# EAGLE board uacs (EAGLE 7.1.0)
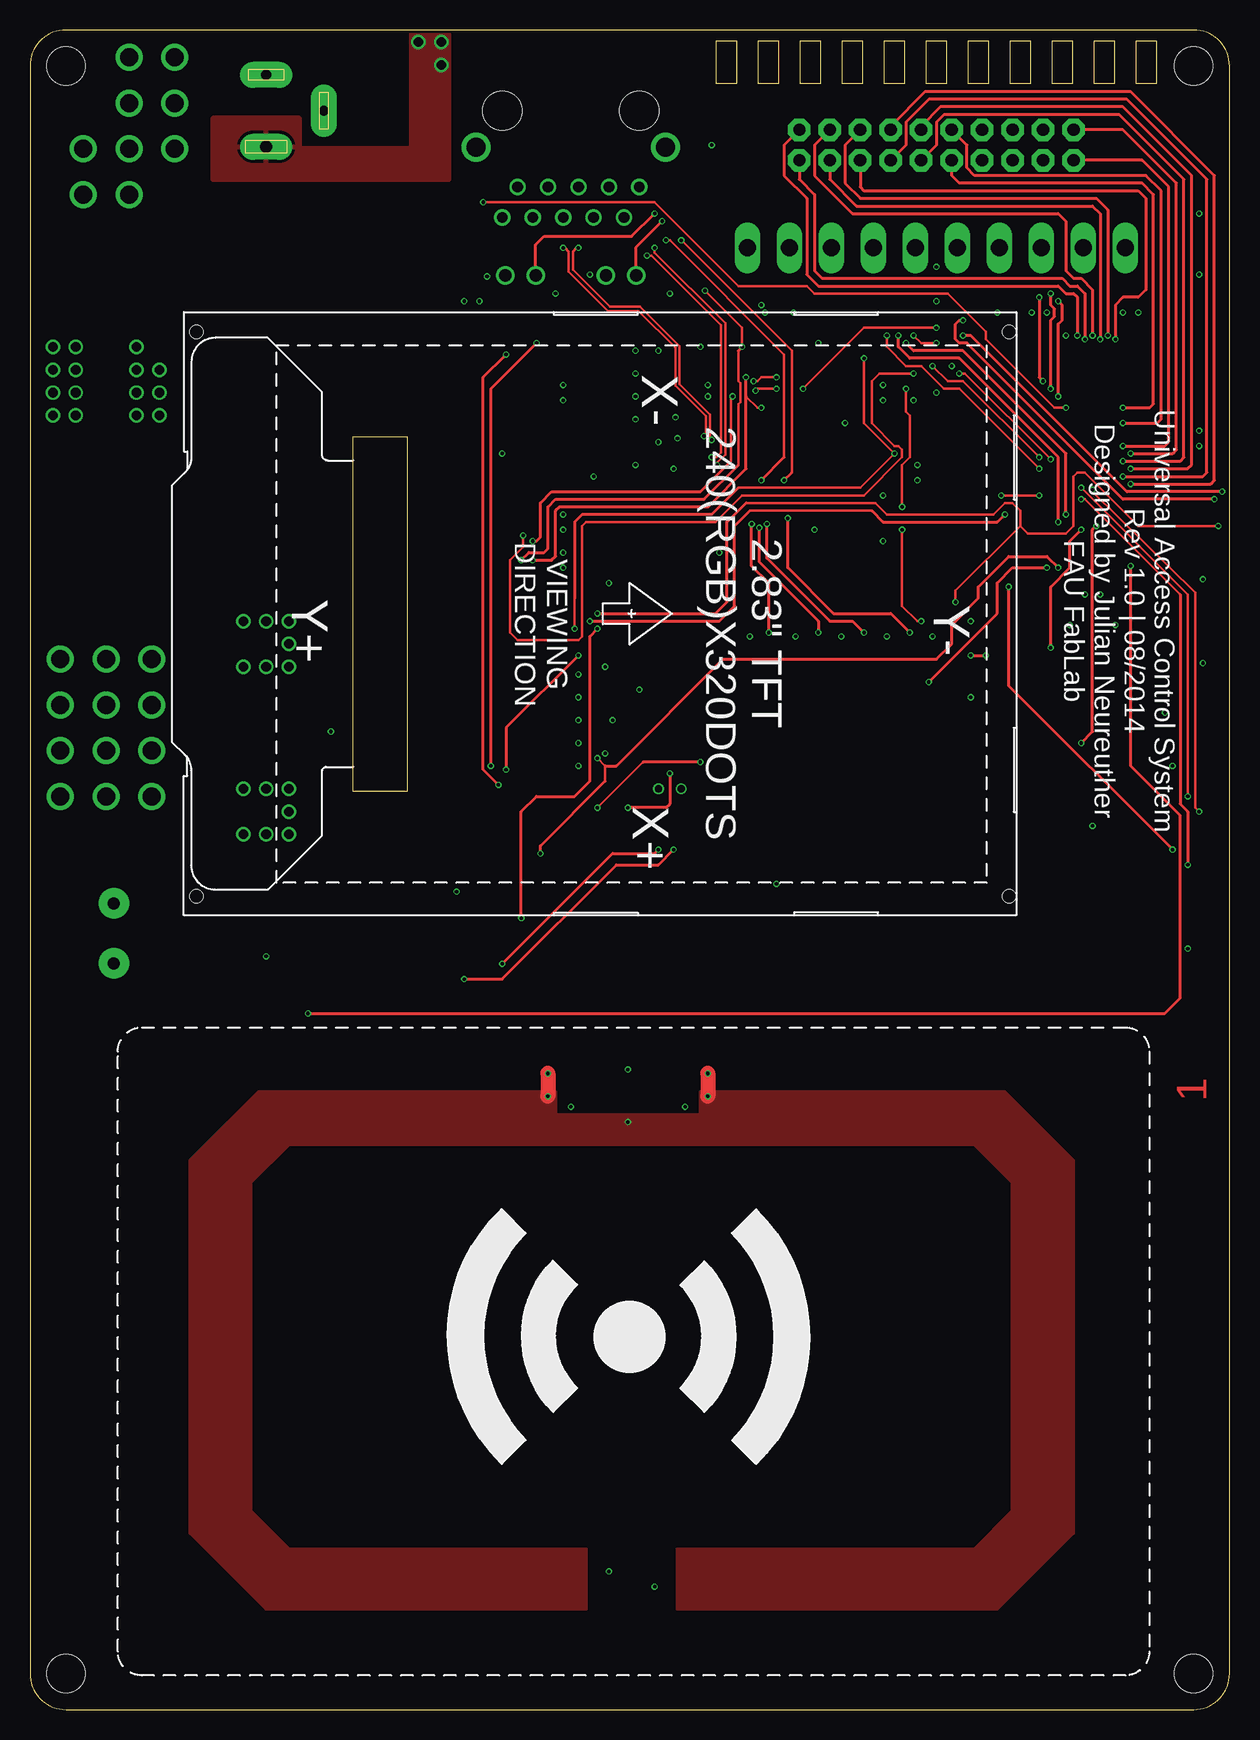
[diagram p5: board, top side]
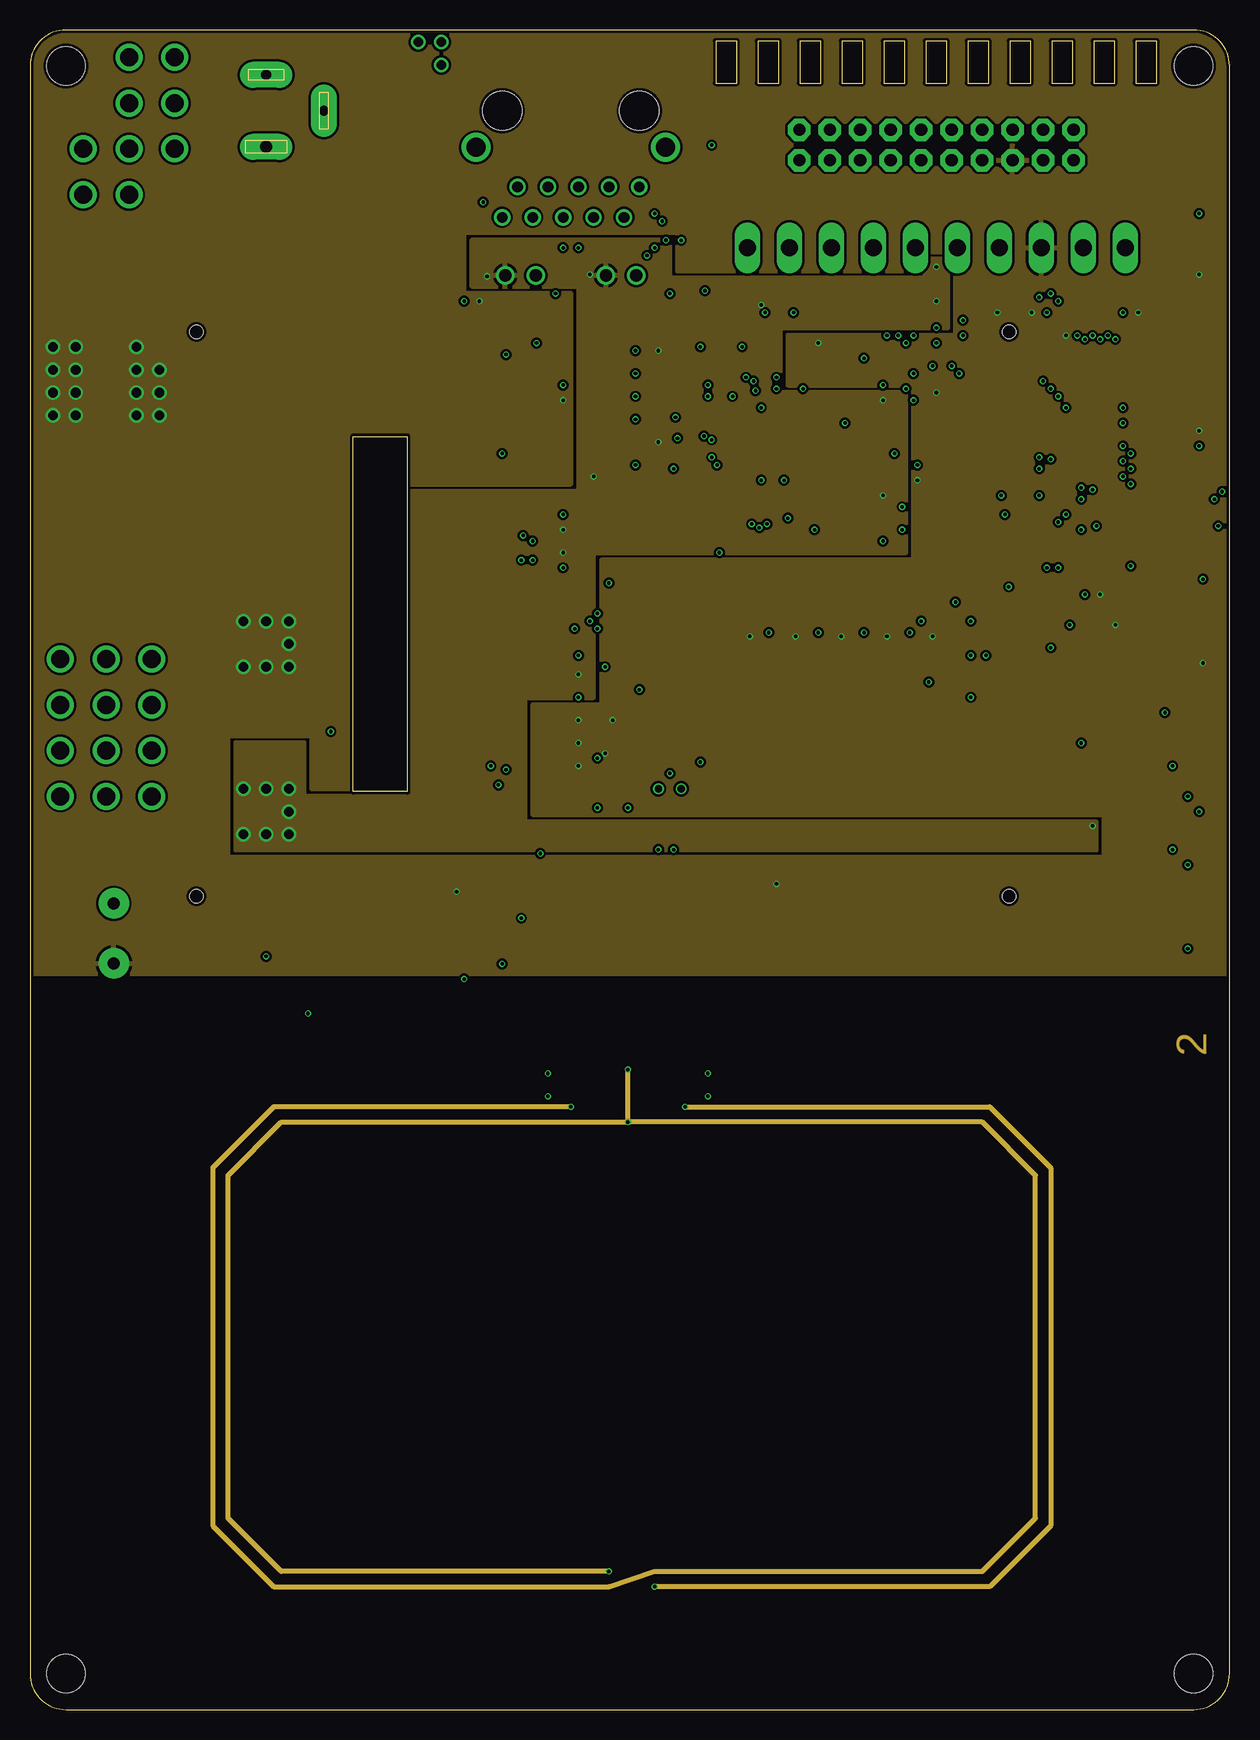
[diagram p6: board, inner layer Route2]
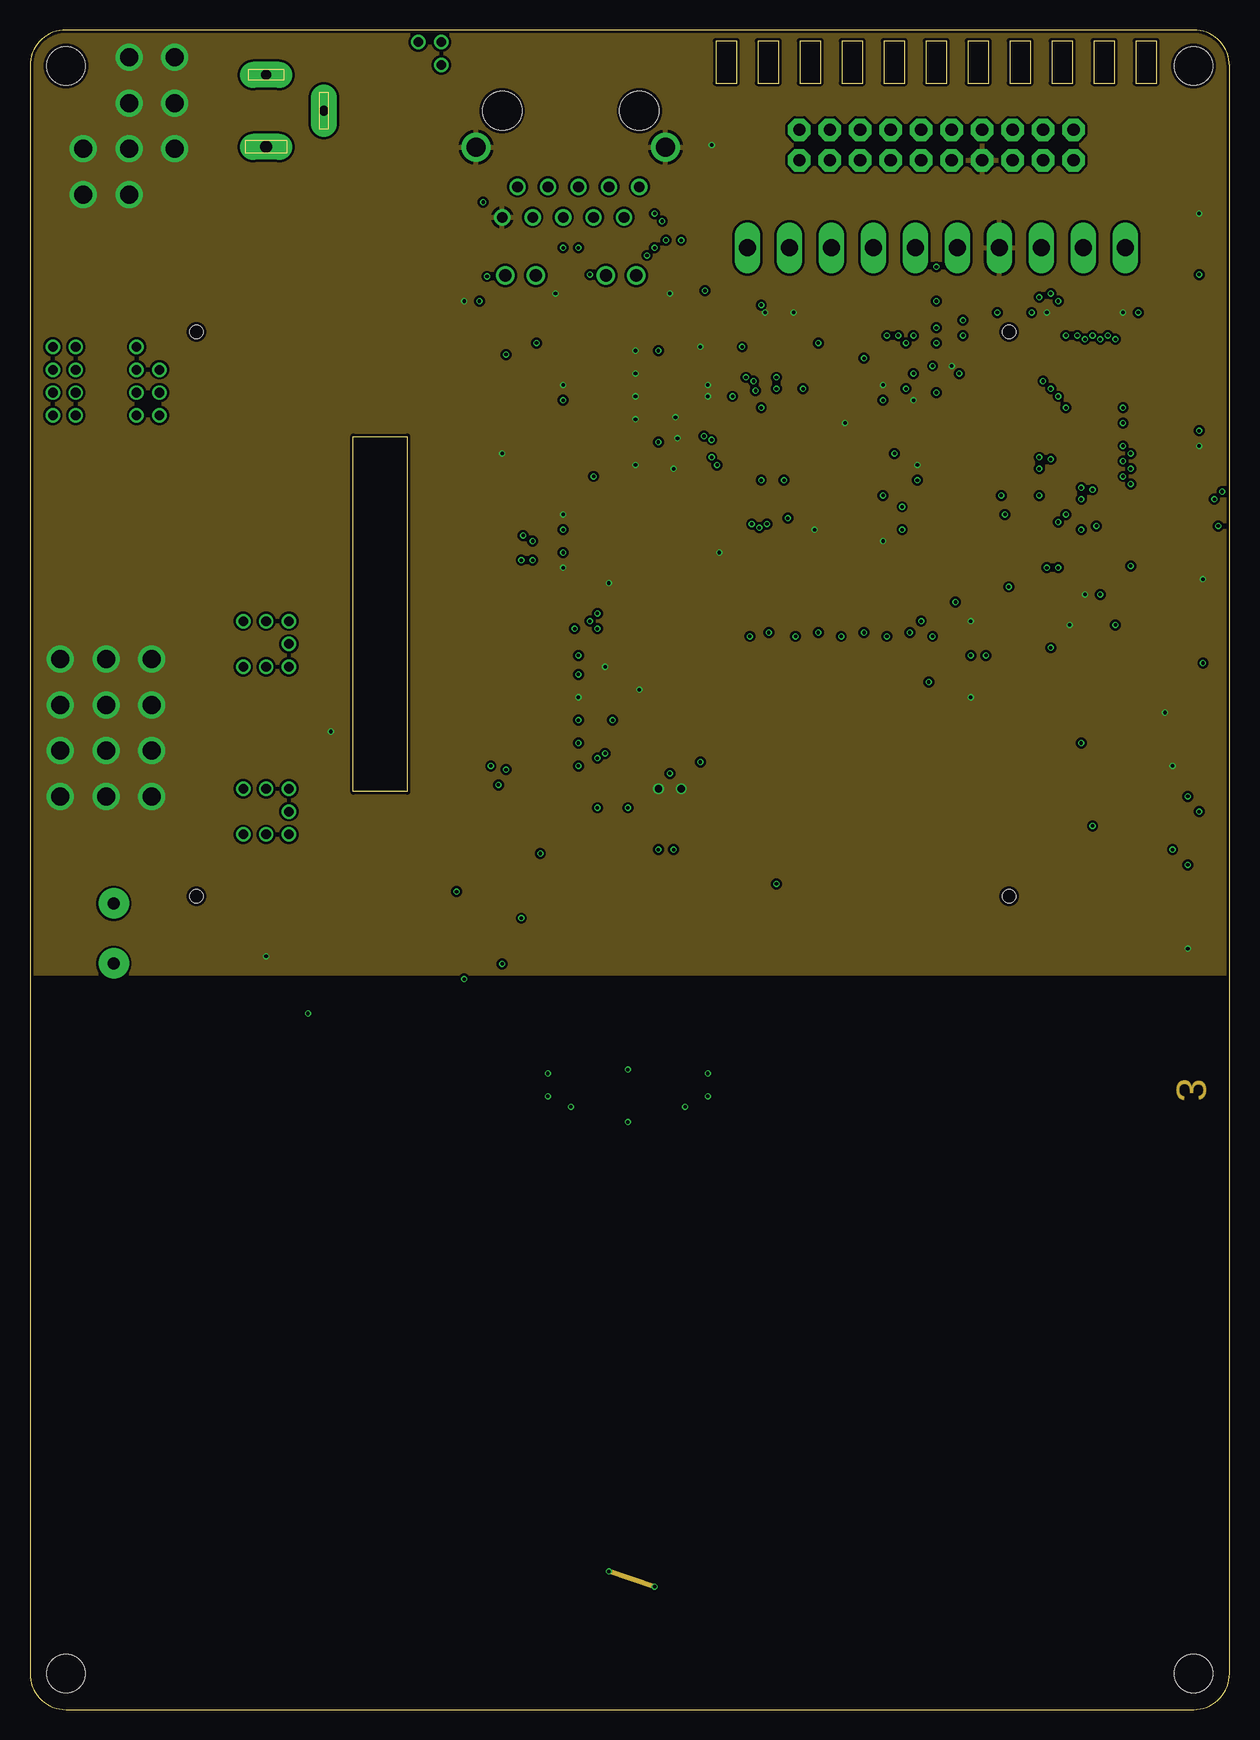
[diagram p7: board, inner layer Route15]
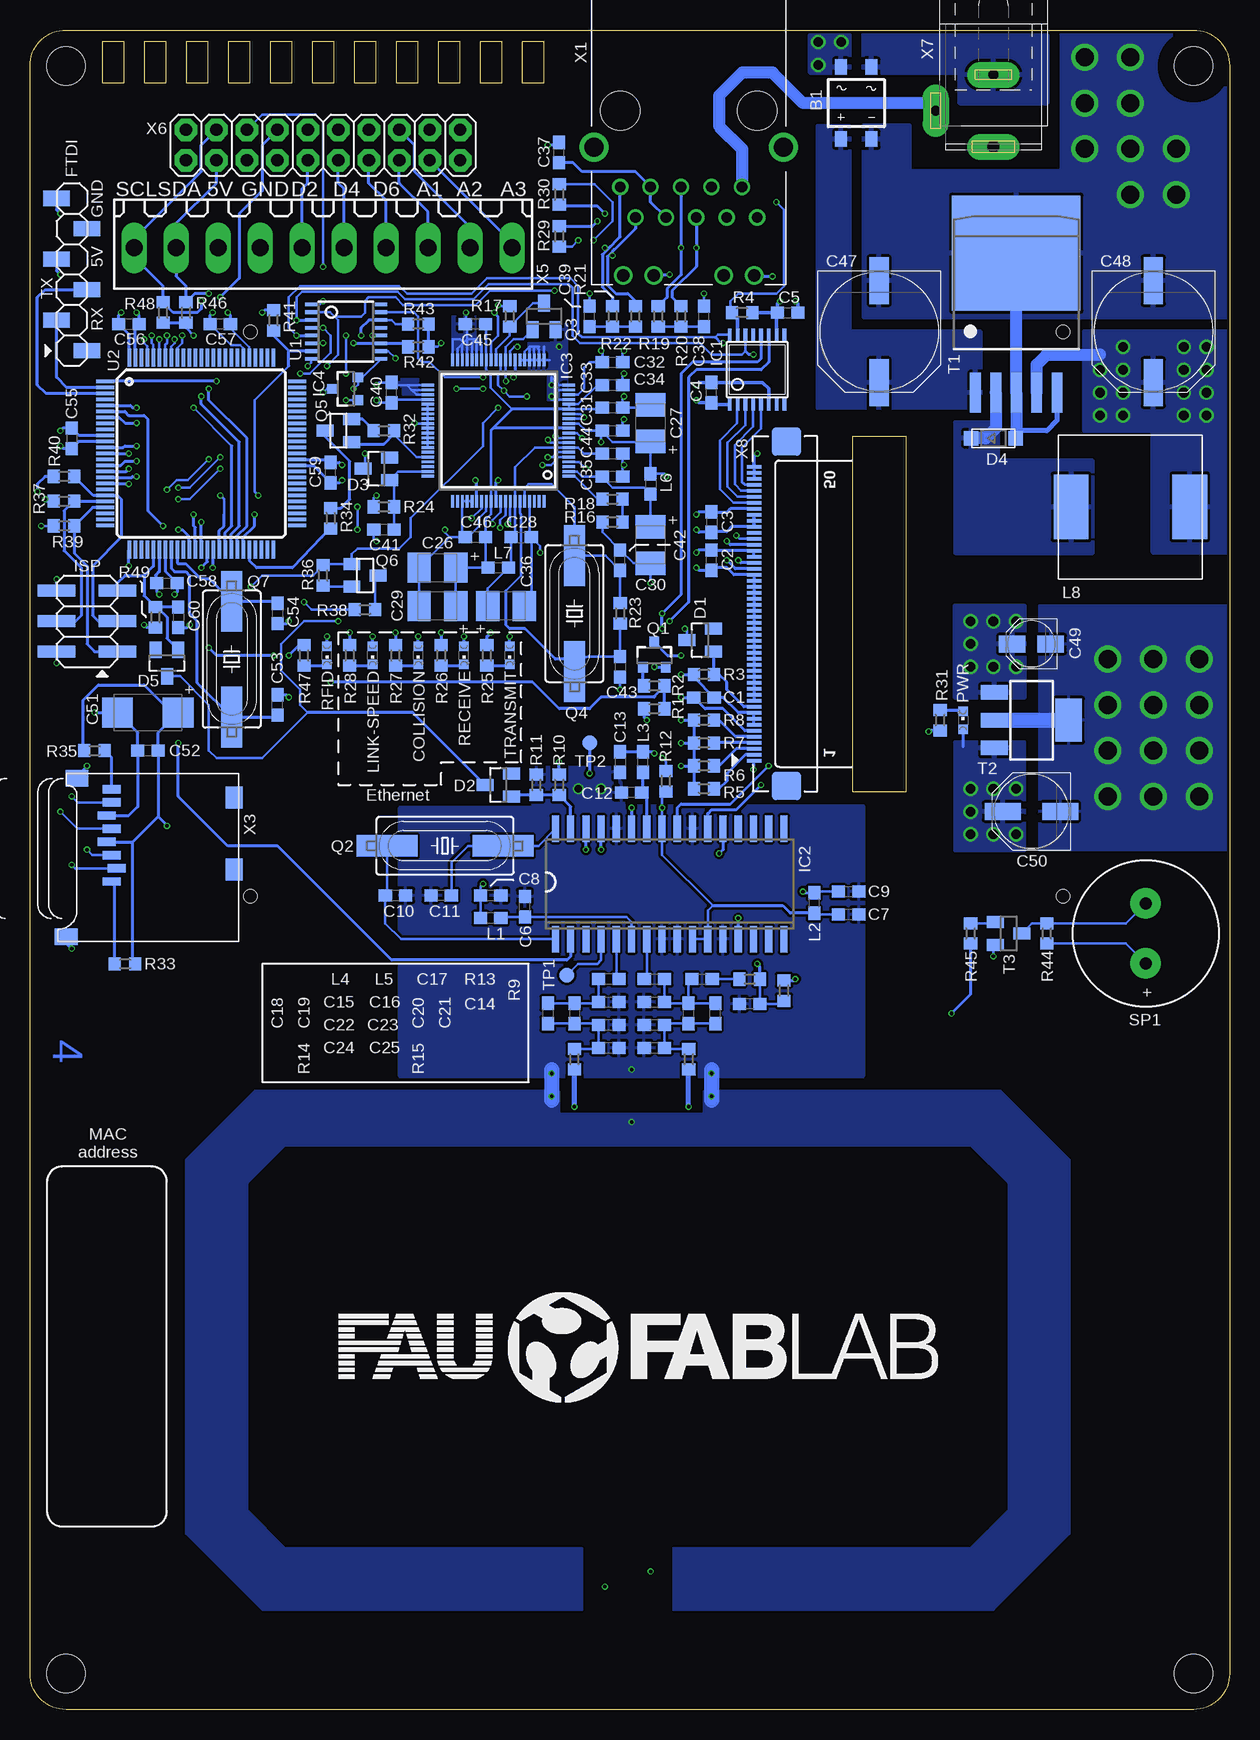
[diagram p8: board, bottom side, seen from below]

Size 100 x 140 mm. Coordinates in mm from the lower left corner, seen from the top.
Outline: 0,137 0,3 arc90 3,0 97,0 arc90 100,3 100,137 arc90 97,140 3,140 arc90 0,137
Outline: 57.18,139.08 57.18,135.58 58.93,135.58 58.93,139.08 57.18,139.08
Outline: 60.68,139.08 60.68,135.58 62.43,135.58 62.43,139.08 60.68,139.08
Outline: 64.18,139.08 64.18,135.58 65.93,135.58 65.93,139.08 64.18,139.08
Outline: 67.68,139.08 67.68,135.58 69.43,135.58 69.43,139.08 67.68,139.08
Outline: 71.18,139.08 71.18,135.58 72.93,135.58 72.93,139.08 71.18,139.08
Outline: 74.68,139.08 74.68,135.58 76.43,135.58 76.43,139.08 74.68,139.08
Outline: 78.18,139.08 78.18,135.58 79.93,135.58 79.93,139.08 78.18,139.08
Outline: 81.68,139.08 81.68,135.58 83.43,135.58 83.43,139.08 81.68,139.08
Outline: 85.18,139.08 85.18,135.58 86.93,135.58 86.93,139.08 85.18,139.08
Outline: 88.68,139.08 88.68,135.58 90.43,135.58 90.43,139.08 88.68,139.08
Outline: 92.18,139.08 92.18,135.58 93.93,135.58 93.93,139.08 92.18,139.08
Copper layers (1*2*15*16): Top 0.035mm / dielectric 0.2mm / Route2 0.0175mm / dielectric 0.3mm / Route15 0.0175mm / dielectric 0.2mm / Bottom 0.035mm
Design rules "SeeedStudio_4layer_DRU_no_angle_20140221 *": minimum track width 6mil, minimum drill 0.3mm, track to track 8mil, track to pad 8mil, pad to pad 8mil, via to via 8mil, smd to smd 0mil, copper to edge 10mil, drill to drill 8mil, minimum pad ring 6mil, minimum via ring 4mil, stop-mask expansion 4mil, vias tented up to drill 100mil, thermal gap 10mil
Holes 3.2 mm at 3,137 97,137 3,3 97,3
tRestrict: area 0,134 to 6,140; area 94,134 to 100,140; area 94,0 to 100,6; area 0,0 to 6,6
bRestrict: area 0,134 to 6,140; area 94,134 to 100,140; area 94,0 to 100,6; area 0,0 to 6,6
Milling: 44 lines

## Footprints (pad centres in the part's own frame; a part is rotated, then mirrored left to right if it is on the bottom)
MBS = smd 1 x 1.3: + -1.27,-3; - 1.27,-3; AC1 -1.27,3; AC2 1.27,3
C0603 = smd 1.1 x 1: 1 -0.85,0; 2 0.85,0
B/3528-21R = smd 1.95 x 2.5: + 1.525,0; - -1.525,0
PANASONIC_G = smd 3.9 x 1.6: + 4.25,0; - -4.25,0
PANASONIC_B = smd 2.2 x 1.4: + 1.6,0; - -1.6,0
PANASONIC_D = smd 3 x 1.4: + 2.4,0; - -2.4,0
C/6032-28R = smd 2.55 x 2.5: + 2.525,0; - -2.525,0
CHIPLED_0603 = smd 0.8 x 0.8: A 0,-0.75; C 0,0.75
SOT23 = smd 1 x 1.4: 1 -0.95,-1.1; 2 0.95,-1.1; 3 0,1.1
SOD-123 = smd 1.2 x 1.2: A 1.85,0; C -1.85,0
1X6 = smd 1.27 x 2.2: 1 6.35,1.27; 2 3.81,-1.27; 3 1.27,1.27; 4 -1.27,-1.27; 5 -3.81,1.27; 6 -6.35,-1.27
TSSOP16 = smd 0.305 x 0.991: 1 -2.925,-2.918; 2 -2.275,-2.918; 3 -1.625,-2.918; 4 -0.975,-2.918; 5 -0.325,-2.918; 6 0.325,-2.918; 7 0.975,-2.918; 8 1.625,-2.918; 9 1.625,2.918; 10 0.975,2.918; 11 0.325,2.918; 12 -0.325,2.918; 13 -0.975,2.918; 14 -1.625,2.918; 15 -2.275,2.918; 16 -2.925,2.918
SO32 = smd 0.6 x 2.2: 1 -9.525,-4.6; 2 -8.255,-4.6; 3 -6.985,-4.6; 4 -5.715,-4.6; 5 -4.445,-4.6; 6 -3.175,-4.6; 7 -1.905,-4.6; 8 -0.635,-4.6; 9 0.635,-4.6; 10 1.905,-4.6; 11 3.175,-4.6; 12 4.445,-4.6; 13 5.715,-4.6; 14 6.985,-4.6; 15 8.255,-4.6; 16 9.525,-4.6; 17 9.525,4.6; 18 8.255,4.6; 19 6.985,4.6; 20 5.715,4.6; 21 4.445,4.6; 22 3.175,4.6; 23 1.905,4.6; 24 0.635,4.6; 25 -0.635,4.6; 26 -1.905,4.6; 27 -3.175,4.6; 28 -4.445,4.6; 29 -5.715,4.6; 30 -6.985,4.6; 31 -8.255,4.6; 32 -9.525,4.6
SQFP-S-10X10-80 = smd 0.241 x 1.041: 1 -3.8,-5.879; 2 -3.4,-5.879; 3 -3,-5.879; 4 -2.6,-5.879; 5 -2.2,-5.879; 6 -1.8,-5.879; 7 -1.4,-5.879; 8 -1,-5.879; 9 -0.6,-5.879; 10 -0.2,-5.879; 11 0.2,-5.879; 12 0.6,-5.879; 13 1,-5.879; 14 1.4,-5.879; 15 1.8,-5.879; 16 2.2,-5.879; 17 2.6,-5.879; 18 3,-5.879; 19 3.4,-5.879; 20 3.8,-5.879; 41 3.8,5.879; 42 3.4,5.879; 43 3,5.879; 44 2.6,5.879; 45 2.2,5.879; 46 1.8,5.879; 47 1.4,5.879; 48 1,5.879; 49 0.6,5.879; 50 0.2,5.879; 51 -0.2,5.879; 52 -0.6,5.879; 53 -1,5.879; 54 -1.4,5.879; 55 -1.8,5.879; 56 -2.2,5.879; 57 -2.6,5.879; 58 -3,5.879; 59 -3.4,5.879; 60 -3.8,5.879 | smd 1.041 x 0.241: 21 5.879,-3.8; 22 5.879,-3.4; 23 5.879,-3; 24 5.879,-2.6; 25 5.879,-2.2; 26 5.879,-1.8; 27 5.879,-1.4; 28 5.879,-1; 29 5.879,-0.6; 30 5.879,-0.2; 31 5.879,0.2; 32 5.879,0.6; 33 5.879,1; 34 5.879,1.4; 35 5.879,1.8; 36 5.879,2.2; 37 5.879,2.6; 38 5.879,3; 39 5.879,3.4; 40 5.879,3.8; 61 -5.879,3.8; 62 -5.879,3.4; 63 -5.879,3; 64 -5.879,2.6; 65 -5.879,2.2; 66 -5.879,1.8; 67 -5.879,1.4; 68 -5.879,1; 69 -5.879,0.6; 70 -5.879,0.2; 71 -5.879,-0.2; 72 -5.879,-0.6; 73 -5.879,-1; 74 -5.879,-1.4; 75 -5.879,-1.8; 76 -5.879,-2.2; 77 -5.879,-2.6; 78 -5.879,-3; 79 -5.879,-3.4; 80 -5.879,-3.8
SOT-23-3 = smd 0.8 x 0.9: 1 -0.95,-1; 2 0.95,-1; 3 0,1.1
2X3 = smd 1 x 3.15: 1 -2.54,-2.54; 2 -2.54,2.54; 3 0,-2.54; 4 0,2.54; 5 2.54,-2.54; 6 2.54,2.54
0603 = smd 1.1 x 1: 1 -0.85,0; 2 0.85,0
WE-PD_1260/1245/1280/1210 = smd 2.9 x 5.4: 1 -4.95,0; 2 4.95,0
MI0283QT-11 = smd 1.2 x 0.275 bottom: 1 -10.525,-12.268; 2 -10.525,-11.768; 3 -10.525,-11.268; 4 -10.525,-10.768; 5 -10.525,-10.268; 6 -10.525,-9.768; 7 -10.525,-9.268; 8 -10.525,-8.768; 9 -10.525,-8.268; 10 -10.525,-7.768; 11 -10.525,-7.268; 12 -10.525,-6.768; 13 -10.525,-6.268; 14 -10.525,-5.768; 15 -10.525,-5.268; 16 -10.525,-4.768; 17 -10.525,-4.268; 18 -10.525,-3.768; 19 -10.525,-3.268; 20 -10.525,-2.768; 21 -10.525,-2.268; 22 -10.525,-1.768; 23 -10.525,-1.268; 24 -10.525,-0.768; 25 -10.525,-0.268; 26 -10.525,0.232; 27 -10.525,0.732; 28 -10.525,1.232; 29 -10.525,1.732; 30 -10.525,2.232; 31 -10.525,2.732; 32 -10.525,3.232; 33 -10.525,3.732; 34 -10.525,4.232; 35 -10.525,4.732; 36 -10.525,5.232; 37 -10.525,5.732; 38 -10.525,6.232; 39 -10.525,6.732; 40 -10.525,7.232; 41 -10.525,7.732; 42 -10.525,8.232; 43 -10.525,8.732; 44 -10.525,9.232; 45 -10.525,9.732; 46 -10.525,10.232; 47 -10.525,10.732; 48 -10.525,11.232; 49 -10.525,11.732; 50 -10.525,12.232 | smd 2.4 x 2.4 bottom: GND2 -13.225,14.332; PAD3 -13.225,-14.368 | hole 1.1: -36.28,-23.57; -36.28,23.47; 31.47,-23.57; 31.47,23.47
SOT23-3 = smd 0.8 x 0.9: 1 -0.95,-1; 2 0.95,-1; 3 0,1.1
SM49 = smd 5.08 x 1.778: 1 -4.826,0; 2 4.826,0
R0603 = smd 1 x 1.1: 1 -0.85,0; 2 0.85,0
PS12 = drill 1 pad 2.54: P$1 -2.5,0; P$2 2.5,0
TO-263-5 = smd 0.9 x 3.3: 1 -3.4,0; 2 -1.7,0; 3 0,0; 4 1.7,0; 5 3.4,0 | smd 10.7 x 9.6: TAB 0,11.616
SOT223 = smd 1.219 x 2.235: 1 -2.311,-3.099; 2 0,-3.099; 3 2.311,-3.099 | smd 3.6 x 2.2: 4 0,3.099
B1,27 = smd 1.27 x 1.27: TP 0,0
TSSOP16' = smd 0.305 x 0.991: 1 -2.275,-2.918; 2 -1.625,-2.918; 3 -0.975,-2.918; 4 -0.325,-2.918; 5 0.325,-2.918; 6 0.975,-2.918; 7 1.625,-2.918; 8 2.275,-2.918; 9 2.275,2.918; 10 1.625,2.918; 11 0.975,2.918; 12 0.325,2.918; 13 -0.325,2.918; 14 -0.975,2.918; 15 -1.625,2.918; 16 -2.275,2.918
TQFP100 = smd 1.5 x 0.3: 1 -8,6; 2 -8,5.5; 3 -8,5; 4 -8,4.5; 5 -8,4; 6 -8,3.5; 7 -8,3; 8 -8,2.5; 9 -8,2; 10 -8,1.5; 11 -8,1; 12 -8,0.5; 13 -8,0; 14 -8,-0.5; 15 -8,-1; 16 -8,-1.5; 17 -8,-2; 18 -8,-2.5; 19 -8,-3; 20 -8,-3.5; 21 -8,-4; 22 -8,-4.5; 23 -8,-5; 24 -8,-5.5; 25 -8,-6; 51 8,-6; 52 8,-5.5; 53 8,-5; 54 8,-4.5; 55 8,-4; 56 8,-3.5; 57 8,-3; 58 8,-2.5; 59 8,-2; 60 8,-1.5; 61 8,-1; 62 8,-0.5; 63 8,0; 64 8,0.5; 65 8,1; 66 8,1.5; 67 8,2; 68 8,2.5; 69 8,3; 70 8,3.5; 71 8,4; 72 8,4.5; 73 8,5; 74 8,5.5; 75 8,6 | smd 0.3 x 1.5: 26 -6,-8; 27 -5.5,-8; 28 -5,-8; 29 -4.5,-8; 30 -4,-8; 31 -3.5,-8; 32 -3,-8; 33 -2.5,-8; 34 -2,-8; 35 -1.5,-8; 36 -1,-8; 37 -0.5,-8; 38 0,-8; 39 0.5,-8; 40 1,-8; 41 1.5,-8; 42 2,-8; 43 2.5,-8; 44 3,-8; 45 3.5,-8; 46 4,-8; 47 4.5,-8; 48 5,-8; 49 5.5,-8; 50 6,-8; 76 6,8; 77 5.5,8; 78 5,8; 79 4.5,8; 80 4,8; 81 3.5,8; 82 3,8; 83 2.5,8; 84 2,8; 85 1.5,8; 86 1,8; 87 0.5,8; 88 0,8; 89 -0.5,8; 90 -1,8; 91 -1.5,8; 92 -2,8; 93 -2.5,8; 94 -3,8; 95 -3.5,8; 96 -4,8; 97 -4.5,8; 98 -5,8; 99 -5.5,8; 100 -6,8
7499210124A = drill 0.9: 1 -5.715,-3.81; 2 -4.445,-6.35; 3 -3.175,-3.81; 4 -1.905,-6.35; 5 -0.635,-3.81; 6 0.635,-6.35; 7 1.905,-3.81; 8 3.175,-6.35; 9 4.445,-3.81; 10 5.715,-6.35 | drill 1.02: 11 -5.465,-11.18; 12 -2.925,-11.18; 13 2.925,-11.18; 14 5.465,-11.18 | drill 1.6: Z1 -7.9,-0.51; Z2 7.9,-0.51 | hole 3.25: 5.715,2.54; -5.715,2.54
MICROSD = smd 0.7 x 1.5: 1 9,-10.64; 2 7.9,-10.24; 3 6.8,-10.64; 4 5.7,-11.04; 5 4.6,-10.64; 6 3.5,-11.04; 7 2.4,-10.64; 8 1.3,-10.64 | smd 1.8 x 1.4: CD1 2,-0.44; CD2 8,-0.44 | smd 1.4 x 1.9: MT1 0.4,-13.54; MT2 13.6,-14.44
180-10 = drill 1.422 long: 1 -15.75,0; 2 -12.25,0; 3 -8.75,0; 4 -5.25,0; 5 -1.75,0; 6 1.75,0; 7 5.25,0; 8 8.75,0; 9 12.25,0; 10 15.75,0
2X10 = drill 1.016 pad 1.88 octagon: 1 -11.43,-1.27; 2 -11.43,1.27; 3 -8.89,-1.27; 4 -8.89,1.27; 5 -6.35,-1.27; 6 -6.35,1.27; 7 -3.81,-1.27; 8 -3.81,1.27; 9 -1.27,-1.27; 10 -1.27,1.27; 11 1.27,-1.27; 12 1.27,1.27; 13 3.81,-1.27; 14 3.81,1.27; 15 6.35,-1.27; 16 6.35,1.27; 17 8.89,-1.27; 18 8.89,1.27; 19 11.43,-1.27; 20 11.43,1.27
SPC4078 = drill 0.8 pad 2.184 long: 1 -3,0; 2 0,-4.8 | drill 1 pad 2.184 long: 3 3,0

## Placement (x,y rotation side)
B1  CDBHD2100-G  [MBS]  31.11,133.91 0 bottom
C1  100n  [C0603]  43.81,84.38 0 bottom
C2  100n  [C0603]  43.18,95.8 90 bottom
C3  100n  [C0603]  43.18,98.98 270 bottom
C4  100n  [C0603]  43.18,109.77 90 bottom
C5  100n  [C0603]  36.83,116.44 0 bottom
C6  100n  [C0603]  58.74,66.91 90 bottom
C7  100n  [C0603]  31.75,66.28 0 bottom
C8  56p  [C0603]  61.59,67.86 0 bottom
C9  56p  [C0603]  31.75,68.18 0 bottom
C10  15p  [C0603]  69.53,67.86 0 bottom
C11  15p  [C0603]  65.72,67.86 180 bottom
C12  100n  [C0603]  49.85,76.44 180 bottom
C13  56p  [C0603]  50.8,78.98 270 bottom
C14  100n  [C0603]  40.01,58.82 180 bottom
C15  68p  [C0603]  51.75,58.97 0 bottom
C16  68p  [C0603]  47.94,58.97 0 bottom
C17  1n  [C0603]  43.97,60.88 0 bottom
C18  20p  [C0603]  56.83,58.02 270 bottom
C19  20p  [C0603]  54.61,58.02 270 bottom
C20  20p  [C0603]  45.09,58.02 90 bottom
C21  20p  [C0603]  42.86,58.02 90 bottom
C22  220p  [C0603]  51.75,57.07 0 bottom
C23  220p  [C0603]  47.94,57.07 0 bottom
C24  200p  [C0603]  51.75,55.16 0 bottom
C25  200p  [C0603]  47.94,55.16 0 bottom
C26  3.3u  [B/3528-21R]  66.04,95.17 0 bottom
C27  10uF  [B/3528-21R]  48.26,107.23 270 bottom
C28  100n  [C0603]  59.05,97.71 0 bottom
C29  10uF  [B/3528-21R]  66.04,91.99 0 bottom
C30  10uF  [B/3528-21R]  48.26,97.08 90 bottom
C31  100n  [C0603]  51.44,106.6 0 bottom
C32  100n  [C0603]  51.44,112.31 0 bottom
C33  100n  [C0603]  51.44,108.5 0 bottom
C34  100n  [C0603]  51.44,110.41 0 bottom
C35  10n  [C0603]  51.44,102.79 0 bottom
C36  10uF  [B/3528-21R]  60.33,91.99 180 bottom
C37  100n  [C0603]  55.88,129.78 90 bottom
C38  100n  [C0603]  43.81,116.12 90 bottom
C39  100n  [C0603]  53.34,116.12 90 bottom
C40  100n  [C0603]  69.85,109.77 90 bottom
C41  47n  [C0603]  70.48,98.34 180 bottom
C42  13p  [C0603]  50.8,95.8 90 bottom
C43  13p  [C0603]  50.8,86.91 270 bottom
C44  100n  [C0603]  51.44,104.69 0 bottom
C45  100n  [C0603]  62.87,115.49 180 bottom
C46  100n  [C0603]  62.87,97.71 180 bottom
C47  100u  [PANASONIC_G]  29.21,114.86 270 bottom
C48  470u  [PANASONIC_G]  6.35,114.86 270 bottom
C49  470n  [PANASONIC_B]  16.51,88.82 180 bottom
C50  33u  [PANASONIC_D]  16.51,74.85 180 bottom
C51  33u  [C/6032-28R]  90.17,83.11 0 bottom
C52  100n  [C0603]  90.17,79.93 180 bottom
C53  22p  [C0603]  79.38,83.74 90 bottom
C54  22p  [C0603]  79.38,91.36 270 bottom
C55  100n  [C0603]  96.52,105.97 270 bottom
C56  100n  [C0603]  91.76,115.49 0 bottom
C57  100n  [C0603]  84.14,115.49 180 bottom
C58  100n  [C0603]  88.58,93.9 0 bottom
C59  100n  [C0603]  74.93,103.11 90 bottom
C60  100n  [C0603]  87.63,91.04 270 bottom
COLLISION  RED  [CHIPLED_0603]  67.63,87.87 180 bottom
D1  BAT54  [SOT23]  44.13,89.14 90 bottom
D2  BAT54  [SOT23]  60.96,77.07 90 bottom
D3  BAT54  [SOT23]  71.12,103.42 90 bottom
D4  PMEG6020ER  [SOD-123]  19.68,105.97 0 bottom
D5  BAT54  [SOT23]  88.58,87.23 180 bottom
FTDI  1X6  [1X6]  96.52,119.62 270 bottom
IC1  TSC2046  [TSSOP16]  38.73,111.68 0 bottom
IC2  MFRC531  [SO32]  46.67,68.82 0 bottom
IC3  W5100  [SQFP-S-10X10-80]  60.96,106.6 90 bottom
IC4  STM809L  [SOT-23-3]  73.66,110.09 90 bottom
ISP  ISP  [2X3]  95.25,90.72 90 bottom
L1  22n  [0603]  61.59,65.96 180 bottom
L2  22n  [0603]  34.61,67.23 90 bottom
L3  22n  [0603]  48.9,78.98 90 bottom
L4  1u  [0603]  51.75,60.88 180 bottom
L5  1u  [0603]  47.94,60.88 0 bottom
L6  1u 250mA  [0603]  48.26,102.16 270 bottom
L7  1u 250mA  [0603]  60.96,95.17 0 bottom
L8  SRR1260-331K  [WE-PD_1260/1245/1280/1210]  8.26,100.25 0 bottom
LINK-SPEED  GRN  [CHIPLED_0603]  71.44,87.87 180 bottom
P1  MI0283QT-11  [MI0283QT-11]  50.16,91.36 0 top
PWR  GREEN  [CHIPLED_0603]  22.23,82.47 0 bottom
Q1  MMBT2222  [SOT23-3]  47.94,87.87 0 bottom
Q2  13.56MHz  [SM49]  65.41,71.99 180 bottom
Q3  2N7002  [SOT23]  57.15,116.12 0 bottom
Q4  25MHz  [SM49]  54.61,91.36 90 bottom
Q5  BSS138  [SOT23]  74.3,106.6 90 bottom
Q6  BSS138  [SOT23]  72.07,94.53 270 bottom
Q7  16MHz  [SM49]  83.19,87.55 270 bottom
R1  1k  [R0603]  47.94,83.42 0 bottom
R2  1k  [R0603]  47.94,85.33 180 bottom
R3  10K  [R0603]  43.81,86.28 180 bottom
R4  10K  [R0603]  40.64,116.44 0 bottom
R5  100R  [R0603]  43.81,76.75 180 bottom
R6  100R  [R0603]  43.81,78.66 180 bottom
R7  100R  [R0603]  43.81,80.56 180 bottom
R8  100R  [R0603]  43.81,82.47 180 bottom
R9  820R  [R0603]  37.15,59.93 270 bottom
R10  10k  [R0603]  55.88,77.07 90 bottom
R11  10k  [R0603]  57.78,77.07 270 bottom
R12  10k  [R0603]  46.99,77.39 270 bottom
R13  1k  [R0603]  40.01,60.88 180 bottom
R14  0R  [R0603]  54.61,54.21 270 bottom
R15  0R  [R0603]  45.09,54.21 270 bottom
R16  300R  [R0603]  51.44,98.98 0 bottom
R17  1k  [R0603]  60.01,116.12 270 bottom
R18  12k  [R0603]  51.44,100.88 180 bottom
R19  49R9  [R0603]  47.62,116.12 90 bottom
R20  49R9  [R0603]  45.72,116.12 90 bottom
R21  49R9  [R0603]  51.44,116.12 90 bottom
R22  49R9  [R0603]  49.53,116.12 90 bottom
R23  1M  [R0603]  50.8,91.36 90 bottom
R24  10k  [R0603]  70.48,100.25 180 bottom
R25  150R  [R0603]  61.91,87.87 270 bottom
R26  150R  [R0603]  65.72,87.87 270 bottom
R27  150R  [R0603]  69.53,87.87 270 bottom
R28  100R  [R0603]  73.34,87.87 270 bottom
R29  5R6  [R0603]  55.88,122.79 270 bottom
R30  68R  [R0603]  55.88,126.29 90 bottom
R31  5R6  [R0603]  24.13,82.47 270 bottom
R32  10k  [R0603]  70.48,106.6 0 bottom
R33  10k  [R0603]  92.08,62.15 0 bottom
R34  10k  [R0603]  74.93,99.3 270 bottom
R35  10k  [R0603]  94.61,79.93 180 bottom
R36  10k  [R0603]  75.56,94.53 90 bottom
R37  4k7  [R0603]  97.16,100.73 180 bottom
R38  10k  [R0603]  72.07,91.68 180 bottom
R39  4k7  [R0603]  97.16,98.66 180 bottom
R40  4k7  [R0603]  97.16,102.79 180 bottom
R41  10k  [R0603]  79.69,115.81 90 bottom
R42  10k  [R0603]  67.63,113.58 0 bottom
R43  10k  [R0603]  67.63,115.49 0 bottom
R44  1k  [R0603]  15.24,64.69 270 bottom
R45  1k  [R0603]  21.59,64.69 90 bottom
R46  10k  [R0603]  87,116.44 270 bottom
R47  100R  [R0603]  77.15,87.87 270 bottom
R48  10k  [R0603]  88.9,116.44 270 bottom
R49  10k  [R0603]  89.53,91.04 90 bottom
RECEIVE  YLW  [CHIPLED_0603]  63.82,87.87 180 bottom
RFID  BLUE  [CHIPLED_0603]  75.25,87.87 180 bottom
SP1  PS1240P02BT  [PS12]  6.99,64.69 270 bottom
T1  TL2575-05  [TO-263-5]  17.78,109.77 0 bottom
T2  LM3940IMP-3.3  [SOT223]  16.51,82.47 270 bottom
T3  BC847  [SOT23]  18.41,64.69 270 bottom
TP1  PTR1B1,27  [B1,27]  55.24,61.2 90 bottom
TP2  PTR1B1,27  [B1,27]  53.34,80.56 90 bottom
TRANSMIT  YLW  [CHIPLED_0603]  60.01,87.87 180 bottom
U1  [TSSOP16']  73.66,114.86 270 bottom
U2  ATMEGA640/1280/2560  [TQFP100]  85.72,104.69 0 bottom
X1  7499210124A  [7499210124A]  45.09,130.73 0 bottom
X3  MICROSD  [MICROSD]  82.55,78.02 270 bottom
X5  [180-10]  75.56,121.84 180 bottom
X6  [2X10]  75.56,130.41 0 bottom
X7  [SPC4078]  19.68,133.27 270 bottom

## Tracks (layer width: path | path; a pad name or v marks a point on that pad's centre or on a via)
1V8_OUT
  Bottom 0.203: C34.1 52.7,110.41 54.31,108.8 IC3.16 IC3.15 | C33.1 52.39,108.4 IC3.15 | C45.1 61.96,115.49 IC3.33 61.96,111.73 61.59,111.36 61.59,110.2 59.8,108.4 | 61.56,106.64 IC3.69 61.56,99.65 62.02,99.2 C46.1 62.02,95.38 L7.1 C26.+ C29.+ | IC3.15 55.98,108.4
  Bottom 0.254: IC3.15 59.8,108.4 61.4,106.8 | IC3.11 61.4,106.8 | 61.4,106.8 61.56,106.64
1V8A
  Bottom 0.203: C44.1 53.82,104.7 54.32,105.2 IC3.7 57.91,105.2 59.56,103.56 IC3.74 59.56,98.06 C28.1 59.91,95.38 L7.2 61.85,93.43 C36.+
3V3A
  Bottom 0.203: IC3.2 54.38,103.2 53.98,102.79 C35.1 52.28,102.69 51.44,101.84 48.79,101.84 L6.2 C30.+
!PENIRQ  (via drill 0.3)
  Top 0.203: 60.01,99.93 70.17,99.93
  Top 0.254: v46.67,90.73 57.47,90.73 58.74,92 58.74,98.66 60.01,99.93 | 70.17,99.93 71.12,98.98 80.64,98.98 v81.28,99.62
  Bottom 0.254: U2.45 82.22,97.72 81.28,98.66 v81.28,99.62 | IC1.11 38.41,112.32 39.05,111.68 44.45,111.68 45.09,111.05 45.09,92.31 v46.67,90.73
!RESET  (via drill 0.3)
  Top 0.203: v74.3,90.73 73.98,90.73 72.71,92 v72.71,98.35 | v72.71,100.25 72.71,103.74 73.34,104.38 73.34,107.87 73.03,108.19 v73.03,110.09
  Bottom 0.203: U1.9 72.28,111.04 IC4.2 72.66,110.46 v73.03,110.09 | D5.3 87.48,86.13 85.09,83.74 85.09,79.93 84.45,79.3 80.64,79.3 76.83,83.11 77.47,83.74 77.47,85.01 79.06,86.6 79.06,88.82 77.15,90.73 v74.3,90.73 | v72.71,98.35 v72.71,100.25
  Bottom 0.254: D2.3 68.09,83.11 76.83,83.11
!RESET_3V3  (via drill 0.3)
  Top 0.203: v69.53,112.63 69.53,107.24 v72.07,104.7 69.22,101.84 59.05,101.84 | 45.4,92.63 v45.4,90.09
  Top 0.254: 59.05,101.84 56.83,99.62 46.04,99.62 45.4,98.98 45.4,92.63
  Bottom 0.203: U1.10 70.13,113.23 v69.53,112.63 | D3.3 72.07,103.57 v72.07,104.7 | v45.4,90.09 45.23,89.92 D1.3
!RESET_PRG
  Bottom 0.254: U2.30 89.72,95.3 90.49,94.54 | 90.49,94.54 90.49,92.85 R49.2 | C60.1 R49.2 | R49.2 89.43,91.89 88.58,91.04 88.58,89.28 D5.1 | ISP.5 92.71,93.9 92.08,94.54 90.49,94.54
!RFID_IRQ  (via drill 0.3)
  Top 0.254: v87.63,80.57 88.58,81.52 88.58,98.35 v88.9,98.66
  Bottom 0.254: U2.6 92.08,108.2 91.76,107.87 90.49,107.87 90.17,107.55 90.17,99.93 v88.9,98.66 | IC2.2 54.93,62.79 55.24,62.47 69.85,62.47 79.38,71.99 83.5,71.99 87.63,76.12 v87.63,80.57
!RFID_SS  (via drill 0.3)
  Top 0.203: 47.94,77.39 47.94,78.66 v47.31,79.3
  Top 0.254: v42.55,71.36 42.55,71.99 47.94,77.39 | 47.94,78.66 48.9,78.66 57.78,87.55 75.56,87.55 76.83,88.82 76.83,90.41 79.06,92.63 79.06,93.58 81.6,96.12 84.77,96.12 v85.72,95.17
  Bottom 0.203: v47.31,79.3 46.99,78.98 R12.1
  Bottom 0.254: IC2.21 42.23,71.68 v42.55,71.36 | v85.72,95.17 85.22,95.67 U2.39
!SD_SS  (via drill 0.3)
  Top 0.254: v86.36,99.62 86.36,104.7 77.79,113.27 73.66,113.27 v73.03,113.9
  Bottom 0.254: U2.37 86.22,98.53 86.36,98.66 v86.36,99.62 | v73.03,113.9 73,113.88 U1.11 68.77,113.88 R42.1
!SD_SS_3V3  (via drill 0.3)
  Top 0.203: v71.44,114.54 71.44,113.59 73.03,112 74.3,112 76.2,110.09 77.47,110.09 v84.14,103.43 | 95.89,92.95 87.95,100.89 v87.63,100.89
  Top 0.254: 95.89,92.95 95.89,75.49 96.52,74.85 v96.52,70.41
  Bottom 0.203: U1.12 v71.43,114.53 v71.44,114.54 | X3.2 96.24,70.13 v96.52,70.41 | v87.63,100.89 86.68,100.89 v84.14,103.43
!TFT_SS  (via drill 0.3)
  Top 0.203: v80.96,101.2 v84.14,101.2
  Bottom 0.203: 78.42,112 81.28,109.14 81.28,101.52 v80.96,101.2 | v84.14,101.2 83.82,100.89 83.82,99.62
  Bottom 0.254: U2.41 84.22,98.26 83.82,98.66 83.82,99.62 | U1.7 78.39,113.23 | 78.39,113.23 79.69,114.54 R41.1 | 78.42,112 78.42,113.19 78.39,113.23
!TFT_SS_3V3  (via drill 0.3)
  Top 0.203: v41.12,97.87 41.12,96.92 40.01,95.81 40.01,89.77 40.64,89.14 45.72,89.14 46.04,89.46 46.04,98.66 46.35,98.98 57.15,98.98 59.37,101.2 69.53,101.2 72.71,104.38 72.71,105.01 72.39,105.33 72.07,105.33 70.17,107.24 70.17,110.73 70.8,111.36 v73.66,111.36 | v75.56,113.9 74.3,113.9 v73.66,114.54
  Bottom 0.203: P1.38 40.84,97.59 v41.12,97.87 | v73.66,111.36 v73.66,114.54 | v75.56,113.9 76.56,113.9 U1.6
!TOUCH_SS  (via drill 0.3)
  Top 0.203: v37.78,125.65 52.07,125.65 59.05,118.67 64.77,118.67 65.41,118.03 76.52,118.03 79.69,114.86 79.69,114.22 85.41,108.51 v86.36,108.51
  Bottom 0.203: IC1.15 41.01,115.86 41.59,116.44 41.59,117.4 40.96,118.03 37.78,118.03 37.15,118.67 37.15,125.02 v37.78,125.65 | v86.36,108.51 83.19,105.33
  Bottom 0.254: U2.42 83.72,98.12 83.19,98.66 83.19,105.33
  Bottom 0.305: IC1.15 41.01,115.96 R4.1
!WIZ_IRQ
  Bottom 0.254: R34.2 75.67,97.71 78.11,95.17 81.12,95.17 81.72,95.77 U2.46
!WIZ_IRQ_3V3
  Bottom 0.203: IC3.56 67.75,104.4 69.64,106.28 R32.2
  Bottom 0.254: Q5.1 73.03,105.49 70.48,105.49 69.64,106.34 R32.2
!WIZ_SS  (via drill 0.3)
  Top 0.254: v85.72,98.98 85.72,104.38 77.47,112.63 73.34,112.63 72.39,113.59 v72.39,114.54
  Bottom 0.203: U1.14 69.87,115.83 69.53,115.49 R43.1
  Bottom 0.254: U2.38 v85.72,98.98 | v72.39,114.54 72.39,115.17 71.73,115.83 U1.14
!WIZ_SS_3V3  (via drill 0.3)
  Top 0.203: v62.23,111.05 60.96,111.05 60.64,110.73 v60.33,110.73
  Bottom 0.203: Q3.1 58.91,114.22 59.69,114.22 60.36,113.55 IC3.29 60.36,110.76 v60.33,110.73 | U1.15 67.98,116.48 67.63,116.13 67.63,112.63 67.31,112.32 66.67,112.32 65.41,111.05 v62.23,111.05
+3V3  (via drill 0.3, 0.8)
  Bottom 0.203: IC3.12 54.26,107.2 53.66,106.6 C31.1 | IC3.18 54.31,109.6 53.82,110.09 53.82,111.84 53.34,112.32 C32.1 52.28,113.17 v52.39,113.27 | C31.1 52.28,106.5 51.44,105.65 48.32,105.65 C27.+ L6.1 47.2,103.01 arc90 v46.99,102.79 | IC3.44 69.58,109.2 C40.1 70.91,108.93 v71.12,109.14 | v52.39,105.65 52.39,106.5 C31.1 | X6.6 80.64,132.95 76.2,132.95 75.56,132.32 v75.56,120.25 | U1.1 75.83,117.13 v75.56,117.4 | R24.2 71.33,100.99 v71.12,101.2 | R17.1 60.86,116.98 v60.96,117.08
  Bottom 0.254: P1.35 P1.36 43.12,96.59 C2.2 44.23,96.66 v44.45,96.44 | P1.40 41.5,98.59 41.91,98.19 43.12,98.19 C3.2 44.23,98.13 v44.45,98.35 | P1.7 P1.8 P1.9 40.95,83.09 42.23,84.38 C1.2 44.66,86.08 R3.2 v45.72,86.28 | X1.14 39.53,119.46 v38.1,119.46 | X1.12 47.94,119.62 v46.67,119.62 | 89.32,74.43 C52.1 89.32,81.43 C51.+ 88.19,83.11 90.49,85.41 94.3,85.41 95.57,84.14 95.57,80.03 R35.2 | 89.32,74.43 91.42,72.33 | X3.4 91.42,72.33 | PWR.A 22.23,80.25 | R33.2 91.42,62.35 91.42,72.33 | v88.58,73.66 88.58,73.69 89.32,74.43
  Bottom 0.305: P1.40 P1.41 P1.42
  other vias: 17.78,76.75 19.68,76.75 21.59,76.75 21.59,74.85 21.59,72.94 19.68,72.94 17.78,72.94
  pour Route2: 22.86,80.56 17.14,80.56 17.14,71.67 88.9,71.67 88.9,73.98 41.27,73.98 41.27,84.38 46.99,84.38 46.99,96.44 73.03,96.44 73.03,109.77 62.55,109.77 62.55,115.17 76.52,115.17 76.52,120.89 74.61,120.89 74.61,119.3 53.34,119.3 53.34,122.47 36.83,122.47 36.83,118.66 45.72,118.66 45.72,101.52 31.75,101.52 31.75,76.12 22.86,76.12
  pour Bottom: 17.14,80.56 22.86,80.56 22.86,71.67 17.14,71.67
+5V  (via drill 0.3, 0.8)
  Bottom 0.203: R42.2 66.04,113.59 v65.72,113.9 | IC4.3 75.25,110.09 v75.56,109.78 | C9.1 34.51,68.18 L2.2 35.46,68.08 v35.56,68.18 | L1.2 C8.1 62.45,68.6 v62.23,68.82 | SP1.P$2 8.63,63.84 R44.2 | 83.29,115.28 C57.1 83.29,115.12 81.72,113.55 U2.80
  Bottom 0.254: R5.2 R6.2 R7.2 R8.2 v45.72,82.47 | v45.72,80.57 44.61,80.57 | v45.72,78.66 44.61,78.66 | R46.2 87.21,115.59 | 83.29,115.28 C57.1 83.29,116.23 v83.5,116.44 | U2.100 91.72,114.61 C56.1 92.61,116.23 v92.39,116.44 | U2.10 95.9,106.2 C55.1 97.26,106.82 v97.47,106.6 | ISP.2 v97.79,87.23 | U2.31 89.22,94.85 89.53,94.54 89.53,94 C58.1 89.43,93.16 v89.22,92.95 | R49.1 90.27,90.19 v90.49,90.41 | TRANSMIT.A v60.01,89.46 | RECEIVE.A v63.82,89.46 | COLLISION.A v67.63,89.46 | LINK-SPEED.A v71.44,89.46 | RFID.A v75.25,89.46 | U2.61 76.37,103.7 C59.1 74.19,102.26 v73.98,102.47 | R48.2 R46.2 | R46.2 87,115.17 v86.36,114.54 | R42.2 R43.2 | v47.94,79.69 48.08,79.83 L3.2 C13.1 | R1.1 48.79,82.69 v48.58,82.47 | R41.2 80.43,116.66 v80.64,116.44 | FTDI.4 97.79,119.94 v97.47,119.62
  Bottom 0.305: IC1.10 37.76,116.36 C5.1 | C5.1 R4.2 | C5.1 37.68,117.18 v37.47,117.4 | IC1.1 43.02,108.76 C4.1 44.23,108.93 v44.45,109.14
  Bottom 1.016: T1.4 16.08,112.11 15.24,112.95 10.79,112.95
  other vias: 1.91,113.58 1.91,111.68 1.91,109.77 1.91,107.87 3.81,107.87 3.81,109.77 3.81,111.68 3.81,113.58 8.89,113.58 10.79,111.68 8.89,111.68 8.89,109.77 10.79,109.77 8.89,107.87 10.79,107.87 17.78,90.72 19.68,90.72 21.59,90.72 21.59,88.82 21.59,86.91 19.68,86.91 17.78,86.91
  pour Bottom: 12.06,114.86 0,114.86 0,96.44 6.35,96.44 6.35,106.6 12.06,106.6
  pour Bottom: 17.14,91.99 17.14,84.38 22.86,84.38 22.86,91.99
  pour Route2: 36.2,139.94 3,139.94 arc90 0,136.94 0,61.34 99.85,61.34 99.85,136.94 arc90 96.85,139.94 53.98,139.94 53.98,119.94 73.98,119.94 73.98,121.52 77.15,121.52 77.15,114.54 63.18,114.54 63.18,110.41 73.66,110.41 73.66,95.8 47.62,95.8 47.62,83.74 41.91,83.74 41.91,74.61 89.53,74.61 89.53,71.04 16.51,71.04 16.51,81.2 23.5,81.2 23.5,76.75 26.67,76.75 26.67,106.6 31.75,106.6 31.75,102.16 45.09,102.16 45.09,118.03 36.2,118.03
  pour Route2: 36.2,139.94 53.98,139.94 53.98,123.11 36.2,123.11
A1  (via drill 0.3)
  Top 0.254: X6.15 69.22,126.92 69.53,126.6 92.39,126.6 93.03,125.97 93.03,118.35 92.39,117.71 91.12,117.71 90.49,117.08 v90.49,114.22
  Bottom 0.203: U2.97 90.22,113.64 90.49,113.9 v90.49,114.22
  Bottom 0.254: X5.3 66.81,124.84 69.22,127.24 X6.15
A2  (via drill 0.3)
  Top 0.254: X6.16 67.94,130.41 67.94,127.24 69.22,125.97 88.9,125.97 89.85,125.02 v89.85,114.54
  Bottom 0.203: U2.96 89.72,113.78 89.85,113.9 v89.85,114.54
  Bottom 0.254: X5.2 63.31,123.56 67.94,128.19 67.94,130.41 X6.16
A3  (via drill 0.3)
  Top 0.254: X6.17 66.67,127.56 68.9,125.33 88.58,125.33 89.22,124.7 v89.22,114.22
  Bottom 0.203: U2.95 v89.22,114.21 v89.22,114.22
  Bottom 0.254: X5.1 59.81,122.28 X6.17
A4  (via drill 0.3)
  Top 0.254: X6.18 65.41,130.41 65.41,127.87 68.58,124.7 85.72,124.7 86.36,124.06 86.36,119.94 87,119.3 87.63,119.3 88.58,118.35 v88.58,114.54
  Bottom 0.203: U2.94 88.72,113.76 88.58,113.9 v88.58,114.54
A5  (via drill 0.3)
  Top 0.254: X6.19 64.14,127.56 65.41,126.29 65.41,119.94 66.04,119.3 86.04,119.3 86.68,118.67 87.31,118.67 87.95,118.03 v87.95,114.22
  Bottom 0.203: U2.93 88.22,113.63 87.95,113.9 v87.95,114.22
A6  (via drill 0.3)
  Top 0.254: X6.20 62.87,130.41 62.87,127.87 64.77,125.97 64.77,119.62 65.72,118.67 85.72,118.67 86.36,118.03 87,118.03 87.31,117.71 v87.31,114.54
  Bottom 0.203: U2.92 87.72,113.49 87.31,113.9 v87.31,114.54
ANT_RX  (via drill 0.3)
  Top 0.254: v39.37,62.15 48.58,71.36 52.07,71.36 v52.39,71.68
  Bottom 0.203: R13.1 C14.1 37.41,58.82 R9.2
  Bottom 0.254: R13.1 39.16,61.94 v39.37,62.15 | v52.39,71.68 IC2.29
ANT_TX1
  Bottom 0.203: IC2.5 51.12,61.1 L4.1
ANT_TX2
  Bottom 0.203: IC2.7 48.58,60.88 L5.1
AVDD
  Bottom 0.254: IC2.26 48.58,76.02 C12.1 48.9,76.54 L3.1
BUZZ  (via drill 0.3)
  Top 0.254: v23.18,58.02 94.61,58.02 95.89,59.29 95.89,74.53 91.76,78.66 v91.76,95.33
  Bottom 0.254: v23.18,58.02 21.59,59.61 R45.1 | v91.76,95.33 91.76,96.66 U2.26
COIL1  (via drill 0.3)
  Route2 0.406: v54.61,50.25 80.01,50.25 85.09,45.17 85.09,15.32 80.01,10.24 v52.07,10.24 | v48.26,11.51 20.95,11.51 16.51,15.96 16.51,44.53 20.95,48.98 49.69,48.98
  Route15 0.406: v52.07,10.24 v48.26,11.51
  Bottom 0.406: v54.61,50.25 R14.2
COIL2  (via drill 0.3)
  Route2 0.406: v45.09,50.25 20.32,50.25 15.24,45.17 15.24,15.32 20.32,10.24 48.26,10.24 52.07,11.51 79.38,11.51 83.82,15.96 83.82,44.53 79.38,48.98 50.01,48.98
  Bottom 0.406: v45.09,50.25 R15.2
D1  (via drill 0.3)
  Top 0.254: v84.14,117.71 84.14,111.05 v84.45,110.73
  Bottom 0.254: X6.8 80.64,130.41 80.64,126.6 82.55,124.7 82.55,119.3 v84.14,117.71 | v84.45,110.73 93.69,110.73 U2.1
D2  (via drill 0.3)
  Top 0.254: v91.12,108.51 93.34,108.51 93.66,108.82 93.66,126.29 92.71,127.24 77.47,127.24 76.83,127.87 X6.9
  Bottom 0.254: X5.6 77.31,126.76 76.83,127.24 X6.9 | U2.5 91.63,108.7 91.44,108.51 v91.12,108.51
D3  (via drill 0.3)
  Top 0.254: v91.12,107.24 93.98,107.24 94.3,107.55 94.3,126.6 93.03,127.87 78.74,127.87 78.11,128.51 78.11,130.41 X6.10
  Bottom 0.254: U2.7 92.57,107.7 92.08,107.24 v91.12,107.24
D4  (via drill 0.3)
  Top 0.254: v91.12,104.06 95.89,104.06 96.2,104.38 96.2,127.56 90.81,132.95 76.2,132.95 75.56,132.32 75.56,130.41 X6.11
  Bottom 0.254: X5.5 73.81,126.76 74.3,127.24 X6.11 | U2.15 92.44,103.7 92.08,104.06 v91.12,104.06
D5  (via drill 0.3)
  Top 0.254: v91.76,103.43 96.52,103.43 96.84,103.74 96.84,127.87 91.12,133.59 75.88,133.59 74.3,132 X6.12
  Bottom 0.254: U2.16 91.99,103.2 v91.76,103.43
D6  (via drill 0.3)
  Top 0.254: v91.12,102.79 97.79,102.79 98.11,103.11 98.11,127.56 91.44,134.22 74.93,134.22 73.03,132.32 73.03,130.41 X6.13
  Bottom 0.254: X5.4 70.31,125.8 71.75,127.24 X6.13 | U2.17 91.53,102.7 91.44,102.79 v91.12,102.79
D7  (via drill 0.3)
  Top 0.254: v91.76,102.16 98.42,102.16 98.74,102.47 98.74,127.87 91.76,134.86 74.61,134.86 71.75,132 X6.14
  Bottom 0.254: U2.18 91.8,102.2 v91.76,102.16
DVDD  (via drill 0.3)
  Top 0.203: v47.31,75.17 51.12,78.98
  Top 0.254: v55.88,78.98 51.12,78.98
  Bottom 0.203: C7.1 34.51,66.28 L2.1 | IC2.10 IC2.11 43.5,66.6 43.08,67.02 47.31,71.25 IC2.25 v47.31,75.17 47.31,76.22 R12.2
  Bottom 0.254: R10.2 v55.88,78.98 | 46.67,76.12 R12.2 | 43.08,67.02 37.25,67.02 36.62,66.38 L2.1
FDXLED  (via drill 0.3)
  Top 0.203: 62.87,104.38 62.87,112.95 53.34,122.48 v53.02,122.48
  Top 0.254: v60.96,102.47 62.87,104.38
  Bottom 0.203: v53.02,122.48 51.44,124.06 51.44,125.65 52.92,127.14 R30.2
  Bottom 0.254: IC3.70 61.16,102.27 v60.96,102.47
GND  (via drill 0.3, 0.6, 1.5)
  Top 1.27: v56.52,53.02 v56.52,51.12 | v43.18,53.02 v43.18,51.12
  Route2 0.406: 49.85,49.13 v49.85,53.34
  Bottom 0.203: C27.- 48.52,108.51 C33.2 50.59,109.36 v50.48,109.46 | C35.2 50.59,103.64 v50.48,103.74 50.59,103.85 C44.2 | C31.2 50.59,107.45 v50.48,107.55 | C34.2 50.59,111.26 v50.48,111.36 | C32.2 50.59,113.17 v50.48,113.27 | R16.1 52.28,98.14 C42.2 49.7,95.55 C30.- v48.26,93.9 | IC3.37 63.56,114.22 | 63.56,114.22 63.56,115.49 C45.2 63.66,115.49 v63.66,116.44 | IC3.77 58.36,97.87 C28.2 | C28.2 58.2,92.59 C36.- | C46.2 65.03,97.71 | 65.03,97.71 C26.- C29.- | C46.2 63.56,97.87 63.96,98.27 IC3.63 IC3.64 IC3.65 | IC3.68 61.96,99.89 62.55,99.3 62.55,98.66 63.5,97.71 C46.2 | v65.41,98.35 65.41,98.09 65.03,97.71 | v57.47,96.44 57.47,96.97 C28.2 | IC3.41 68.58,110.4 | 68.58,110.4 69.62,110.4 C40.2 70.91,110.63 v71.12,110.41 | IC3.42 68.18,110 | 68.18,110 68.58,110.4 | IC3.43 67.78,109.6 68.18,110 | IC3.49 67.91,107.2 v67.94,107.24 | IC3.49 IC3.48 IC3.47 IC3.46 IC3.45 | IC3.49 IC3.50 IC3.51 IC3.52 IC3.53 IC3.54 | IC3.34 62.36,113.72 62.76,114.12 | 62.87,114.22 63.56,114.22 | IC3.35 62.76,114.12 | 62.76,114.12 62.87,114.22 | IC3.36 63.16,113.93 62.87,114.22 | IC3.38 63.96,113.82 | 63.96,113.82 63.85,113.93 | 63.85,113.93 63.56,114.22 | IC3.39 64.36,113.42 63.96,113.82 | IC3.40 64.76,114.21 64.77,114.22 64.14,114.22 63.85,113.93 | IC3.32 61.56,113.94 60.96,114.54 60.96,116.13 v61.28,116.44 | 57.56,113.59 57.78,113.59 | 57.78,113.59 57.96,113.59 | IC3.23 57.96,113.59 | IC3.24 58.36,113.59 | 58.36,113.59 57.96,113.59 | 58.36,113.59 58.76,113.19 IC3.25 IC3.26 | IC3.20 55.87,110.4 56.52,111.05 v56.52,110.41 56.1,110 IC3.19 | IC3.22 57.56,113.36 57.78,113.59 | 57.15,112.32 57.15,113.59 | 58.9,112.47 56.67,112.47 | IC3.4 54.23,104 v53.66,103.43
  Bottom 0.203: IC3.14 54.1,108 v53.82,107.71 53.93,107.6 IC3.13 | C43.2 v50.8,85.01 | C38.2 v43.81,118.03 | C39.2 v53.34,118.03 | IC3.10 54.41,106.4 v53.98,105.97 | C57.2 83.24,113.74 82.47,113.74 82.22,113.5 U2.81 | IC4.1 v73.66,109.14 | U1.8 76.58,112.25 v76.83,112 | C41.2 71.33,97.61 v71.12,97.39 | T3.2 19.68,63.57 v19.68,62.79 | 96.89,64.43 96.89,63.79 | IC3.17 56.52,109.2 v56.52,109.46
  Bottom 0.254: P1.43 41.59,100.09 41.91,99.77 43.12,99.77 C3.1 44.23,99.83 v44.45,99.62 | P1.11 P1.12 P1.13 P1.14 P1.15 P1.16 P1.17 P1.18 P1.19 P1.20 P1.21 P1.22 P1.23 P1.24 P1.25 P1.26 P1.27 P1.28 P1.29 P1.30 P1.31 P1.32 41.33,94.59 41.91,95.17 42.97,95.17 C2.1 44.23,94.96 v44.45,95.17 | P1.6 40.4,81.59 42.23,83.42 43.71,83.42 C1.1 v45.72,84.38 | P1.50 P1.49 P1.48 | X3.6 91.77,74.53 91.02,75.27 C52.2 91.02,81.43 C51.- v94.61,83.11 | X3.MT1 96.09,77.82 v95.25,78.66 | X3.MT2 96.89,64.43 | R31.2 24.98,81.62 v25.08,81.52 | C57.2 84.99,116.23 v84.77,116.44 | U2.99 91.22,115.17 C56.2 90.91,116.23 v91.12,116.44 | U2.11 95.94,105.7 C55.2 97.26,105.12 v97.47,105.33 | ISP.6 v97.79,94.22 | U2.32 88.72,94.89 C58.2 87.73,93.16 v87.95,92.95 | C60.2 86.89,90.19 v86.68,90.41 | C54.2 78.64,90.51 v78.42,90.73 | C53.2 78.64,84.59 v78.42,84.38 | U2.62 75.17,104.2 C59.2 74.19,103.96 v73.98,103.74 | Q1.2 47.9,86.87 v47.94,86.92 | 96.89,63.79 v96.52,63.42 | C37.2 56.09,130.41 v56.83,130.41 | FTDI.6 97.79,125.02 v97.47,124.7
  Bottom 0.305: C5.2 35.98,117.18 v36.2,117.4 | IC1.6 38.41,110.09 38.95,110.63 C4.2 44.23,110.63 v44.45,110.41 | P1.50 39.64,104.43 v39.37,104.7
  Bottom 0.406: T1.5 14.38,107.46 15.24,106.6 17.78,106.6
  Bottom 1.016: T1.TAB T1.3 17.78,106.6 17.78,105.97 D4.A
  Bottom 1.27: T2.2 T2.4 | 43.18,53.34 43.18,50.8 | 56.52,53.34 56.52,50.8
  other vias: 4.45,126.28 8.26,126.28 4.45,130.09 8.26,130.09 12.06,130.09 12.06,133.91 8.26,133.91 12.06,137.72 8.26,137.72 10.16,87.55 6.35,87.55 2.54,87.55 2.54,83.74 6.35,83.74 10.16,83.74 10.16,79.93 6.35,79.93 2.54,79.93 2.54,76.12 6.35,76.12 10.16,76.12 55.88,113.58 49.85,48.97 52.39,76.76 54.29,76.76
  pour Route15: 3,140 97,140 arc-90 100,137 100.01,61.36 0.32,61.36 0,137 arc-90
  pour Bottom: 30.48,132 30.48,116.12 0,116.12 0,137 arc-90 3,140 13.97,140 13.97,128.19 26.67,128.19 26.67,132
  pour Bottom: 0,91.99 15.88,91.99 15.88,71.67 0,71.67
  pour Bottom: 64.77,112.95 64.77,116.12 62.87,116.12 62.87,114.22 62.23,114.22 62.23,112.95
  pour Bottom: 69.85,110.89 67.63,110.89 67.63,109.62 68.9,109.62 68.9,110.25 69.85,110.25
  pour Bottom: 58.42,113.9 56.52,113.9 56.52,115.49 55.24,115.49 55.24,109.14 56.83,109.14 56.83,111.68 58.42,111.68
  pour Bottom: 69.22,52.78 30.48,52.78 30.48,75.33 50.48,75.33 50.48,78.5 57.15,78.5 58.1,78.5 58.1,75.17 69.22,75.17
  pour Top: 43.81,51.52 43.81,49.61 55.88,49.61 55.88,51.52 81.28,51.52 87,45.8 87,14.68 80.64,8.33 53.98,8.33 53.98,13.41 78.74,13.41 81.92,16.59 81.92,43.89 78.74,47.07 21.59,47.07 18.41,43.89 18.41,16.59 21.59,13.41 46.35,13.41 46.35,8.33 19.68,8.33 13.34,14.68 13.34,45.8 19.05,51.52
  pour Bottom: 43.81,51.52 43.81,49.61 55.88,49.61 55.88,51.52 81.28,51.52 87,45.8 87,14.68 80.64,8.33 53.98,8.33 53.98,13.41 78.74,13.41 81.92,16.59 81.92,43.89 78.74,47.07 21.59,47.07 18.41,43.89 18.41,16.59 21.59,13.41 46.35,13.41 46.35,8.33 19.68,8.33 13.34,14.68 13.34,45.8 19.05,51.52
LED_RFID  (via drill 0.3)
  Top 0.254: v78.42,87.87 v79.69,87.87 | v85.09,88.5 85.09,93.58 86.68,95.17 86.68,97.39 v87.63,98.35
  Bottom 0.254: R47.1 77.57,88.72 v78.42,87.87 | v79.69,87.87 84.45,87.87 v85.09,88.5 | v87.63,98.35 87.31,98.35 86.72,97.76 U2.36
LINKLED  (via drill 0.3)
  Top 0.203: v54.29,122.48 63.5,113.27 63.5,103.11
  Top 0.254: v62.87,102.47 63.5,103.11
  Bottom 0.203: v54.29,122.48 54.83,121.94 R29.2
  Bottom 0.254: IC3.66 62.76,102.37 v62.87,102.47
MISO  (via drill 0.3)
  Top 0.203: v99.06,98.66 92.39,98.66 87.95,103.11 87.31,103.11 87,102.79 87,98.66 86.36,98.03 83.19,98.03 82.55,98.66 | 82.55,98.66 82.55,99.93 81.92,100.57 81.28,100.57 80.33,99.62 71.44,99.62 70.48,100.57 59.69,100.57 | v77.15,92.31 77.15,93.27 82.55,98.66
  Top 0.254: v47.31,91.36 57.15,91.36 58.1,92.31 58.1,98.98 59.69,100.57 | v40.96,65.96 40.96,74.85 42.23,76.12 45.4,76.12 46.67,77.39 46.67,89.46 v47.31,90.09
  Bottom 0.203: R39.2 v99.06,98.66 | R38.2 76.52,91.68 v77.15,92.31
  Bottom 0.254: IC1.12 39.06,112.63 39.37,112.32 44.77,112.32 45.72,111.36 45.72,92.95 v47.31,91.36 v47.31,90.09 | IC2.13 v40.96,65.96
MISO_3V3  (via drill 0.3)
  Top 0.203: v60.96,108.51 60.64,108.51 59.69,109.46
  Top 0.254: v59.69,111.05 59.69,109.46 59.69,103.43 56.52,100.25 44.13,100.25 43.81,99.93 43.81,96.12 43.5,95.81 v41.91,95.81 | v95.25,71.68 81.6,85.33 v81.6,93.58
  Bottom 0.203: v60.96,108.51 62.23,107.24 62.23,105.33 68.26,99.3 68.26,97.71 69.22,96.76 72.71,96.76 73.17,96.29 Q6.1 75.47,95.49 R36.2 76.42,94.54 80.64,94.54 v81.6,93.58 | X3.3 94.8,71.23 v95.25,71.68
  Bottom 0.254: P1.33 41.2,95.09 v41.91,95.81 | IC3.27 59.56,111.18 v59.69,111.05
MISO_PRG
  Bottom 0.254: U2.22 94.77,100.2 R39.1 96.31,96.38 95.25,95.33 95.25,88.82 94.61,88.19 ISP.1
MOSI  (via drill 0.3)
  Top 0.254: v98.74,100.89 91.12,100.89 78.11,113.9 77.47,113.9 77.15,114.22 77.15,115.49 77.47,115.81 v77.79,115.81 | v39.05,77.07 37.78,78.34 37.78,111.05 v39.69,112.95
  Bottom 0.203: IC1.14 40.36,113.23 40.64,112.95 43.18,112.95 44.13,113.9 54.13,113.9 54.77,114.54 54.77,118.51 55.09,118.82 61.75,118.82 63.02,117.55 68.74,117.55 69.37,118.19 77.31,118.19 77.79,117.71 v77.79,115.81
  Bottom 0.254: R37.2 98.58,100.73 v98.74,100.89 | v77.79,115.81 76.6,115.81 U1.3 | IC2.22 43.5,74.69 43.18,75.01 41.12,75.01 v39.05,77.07 | v39.69,112.95 40.08,112.95 40.36,113.23
MOSI_3V3  (via drill 0.3)
  Top 0.203: v56.27,118.27 59.37,115.17 v59.37,113.59 | 59.05,103.74 59.05,108.82 59.21,108.98 59.21,110.57 59.05,110.73 59.05,113.27 | v96.52,76.12 96.52,92.95 v87.63,101.84 | v84.14,104.38 77.79,110.73 76.52,110.73 v75.25,112
  Top 0.254: 59.05,103.74 56.2,100.89 43.81,100.89 43.18,100.25 43.18,96.76 42.86,96.44 41.59,96.44 v40.96,95.81 | 59.05,113.27 v59.37,113.59
  Bottom 0.203: U1.2 74.97,116.48 74.61,116.13 | 74.61,116.13 72.39,116.13 72.07,116.44 72.07,117.4 71.75,117.71 69.53,117.71 68.9,117.08 62.87,117.08 61.65,118.27 v56.27,118.27 | IC3.28 59.96,113.22 59.59,113.59 v59.37,113.59 | X3.7 96.03,75.63 v96.52,76.12 | v75.25,112 74.3,112.95 74.3,115.81 74.61,116.13 | v87.63,101.84 86.68,101.84 v84.14,104.38
  Bottom 0.254: P1.34 40.74,95.59 v40.96,95.81
MOSI_PRG
  Bottom 0.254: U2.21 96.27,100.7 R37.1 96.36,100.73 97.16,99.93 97.16,96.6 95.73,95.17 95.73,91.2 96.2,90.73 ISP.4
N$1
  Bottom 0.254: IC2.31 54.93,75.27 R10.1 R11.2 59.76,76.22 D2.1
N$2  (via drill 0.3)
  Top 0.254: v45.72,87.87 39.69,81.84 v39.69,78.34
  Bottom 0.254: Q1.3 46.84,87.87 v45.72,87.87 | v39.69,78.34 39.64,78.39 P1.1
N$3
  Bottom 0.254: P1.5 41.17,81.09 42.55,82.47 R8.1
N$4
  Bottom 0.254: R2.2 48.89,85.43 Q1.1
N$6
  Bottom 0.254: R47.2 75.35,87.02 RFID.C
N$7
  Bottom 0.254: P1.4 42.94,80.59 R7.1
N$8
  Bottom 0.254: P1.3 41.11,80.09 42.55,78.66 R6.1
N$9
  Bottom 0.254: P1.2 40.34,79.59 41.91,78.03 41.91,77.39 42.55,76.76 R5.1
N$12
  Bottom 0.254: U2.34 87.72,95.58 87.63,95.49 87,95.49 85.72,94.22 85.03,94.22 Q7.1 79.54,92.38 C54.1
N$13
  Bottom 0.254: U2.33 88.22,95.13 87.95,94.85 87,94.85 86.68,94.54 86.68,91.36 86.04,90.73 86.04,85.58 Q7.2 79.54,82.72 C53.1
N$14
  Bottom 0.254: X3.8 93.19,79.36 R35.1
N$15
  Bottom 0.203: IC3.1 54.62,102.8 52.7,100.89 R18.2
N$16  (via drill 0.3)
  Top 0.254: X1.13 42.16,122.09 42.86,122.79 50.16,122.79 v52.07,124.7
  Bottom 0.254: v52.07,124.7 52.7,125.33 55.78,125.33 R30.1
N$17  (via drill 0.3)
  Top 0.254: v52.7,124.06 50.48,121.84 50.48,119.62 X1.11
  Bottom 0.254: R29.1 53.12,123.64 v52.7,124.06
N$18
  Bottom 0.203: IC3.59 69.3,103.2 D3.1 69.64,102.09 R24.1 C41.1
N$19
  Bottom 0.203: R22.1 R21.1 C39.1
N$20
  Bottom 0.254: R25.2 60.11,87.02 TRANSMIT.C
N$21
  Bottom 0.203: C38.1 R20.1 R19.1
N$22  (via drill 0.3)
  Top 0.254: v73.34,89.77 71.75,91.36 66.99,91.36 63.18,95.17 v63.18,99.3
  Bottom 0.203: IC3.67 62.36,100.12 v63.18,99.3 | v63.18,99.3
  Bottom 0.254: v73.34,89.77 R28.1
N$23
  Bottom 0.254: R26.2 63.92,87.02 RECEIVE.C
N$24  (via drill 0.3)
  Top 0.254: v69.53,89.77 68.58,90.73 66.67,90.73 61.44,95.96 v61.44,98.82
  Bottom 0.203: IC3.71 60.76,99.82 61.44,99.14 v61.44,98.82
  Bottom 0.254: v69.53,89.77 R27.1
N$25  (via drill 0.3)
  Top 0.254: v65.72,89.77 65.72,90.73 60.8,95.65 v60.8,98.5
  Bottom 0.203: IC3.72 60.36,99.58 60.8,99.14 v60.8,98.5
  Bottom 0.254: v65.72,89.77 R26.1
N$26  (via drill 0.3)
  Top 0.254: v61.59,89.77 61.59,93.9 60.17,95.33 v60.17,98.82
  Bottom 0.203: IC3.73 59.96,99.03 v60.17,98.82
  Bottom 0.254: R25.1 61.91,89.46 v61.59,89.77
N$27
  Bottom 0.254: R27.2 67.73,87.02 COLLISION.C
N$28
  Bottom 0.254: R28.2 71.54,87.02 LINK-SPEED.C
N$29
  Bottom 0.203: IC3.75 59.16,99.72 59.05,99.62 59.05,94.54 60.33,93.27 | 55.24,87.55 55.24,87.17 Q4.1 arc90 53.38,87.77 C43.1 R23.1
  Bottom 0.254: 55.24,87.55 56.2,87.55 58.74,90.09 60.01,90.09 60.33,90.41 60.33,93.27
N$30
  Bottom 0.203: R23.2 C42.1 52.03,96.19 Q4.2 54.61,100.25 56.52,102.16 58.42,102.16 58.76,101.82 IC3.76
N$31
  Bottom 0.203: C11.1 64.87,70.62 63.5,71.99 Q2.1 57.62,71.99 IC2.32
N$33
  Bottom 0.203: IC2.4 52.39,62.47 52.7,62.15 54.29,62.15 TP1.TP
N$34  (via drill 0.3)
  Top 0.254: v36.2,60.88 39.37,60.88 48.9,70.41 52.39,70.41 v53.66,71.68
  Bottom 0.254: R9.1 36.3,60.78 v36.2,60.88 | v53.66,71.68 IC2.30
N$35  (via drill 0.3)
  Top 0.254: v53.34,78.03 53.34,75.49 53.02,75.17 v49.85,75.17
  Bottom 0.254: TP2.TP v53.34,78.03 | v49.85,75.17 IC2.27
N$36
  Bottom 0.203: L5.2 C16.2 46.99,58.87 C20.2 | C17.1 45.09,60.62 C20.2 | C21.2 C20.2
N$37
  Bottom 0.203: C17.2 R13.2
N$38
  Bottom 0.203: L4.2 C15.1 52.7,58.87 C19.1 C18.1
N$39
  Bottom 0.203: C18.2 C19.2 52.7,57.17 C22.1 C24.1 52.7,55.06 R14.1
N$40
  Bottom 0.203: SP1.P$1 8.63,65.54 R44.1 16.46,65.54 T3.3
N$41
  Bottom 0.203: T3.1 19.61,65.54 R45.2
N$42
  Bottom 0.254: R31.1 22.32,83.32 PWR.C
N$43
  Bottom 0.203: C21.1 C20.1 46.99,57.17 C23.2 C25.2 46.99,55.06 R15.1
N$44
  Bottom 0.203: R18.1 R16.2
N$45  (via drill 0.8)
  other vias: 32.38,138.98 34.29,138.98 34.29,137.08
  pour Top: 22.48,132.63 15.24,132.63 15.24,127.55 34.92,127.55 34.92,139.62 31.75,139.62 31.75,130.09 22.48,130.09
  pour Bottom: 31.75,139.62 31.75,136.44 34.92,136.44 34.92,139.62
N$46
  pour Bottom: 15.24,139.62 15.24,133.91 22.48,133.91 22.48,136.44 30.48,136.44 30.48,139.62
N$47
  Bottom 0.203: R38.1 71.22,94.29 Q6.3
N$48
  Bottom 1.016: T1.2 19.48,106.81 20.32,105.97 D4.C
  pour Bottom: 22.86,96.44 11.43,96.44 11.43,104.06 19.3,104.06 19.3,107.23 22.86,107.23
N$49
  Bottom 0.203: Q6.2 75.47,93.59 R36.1
N$50
  Bottom 0.254: R32.1 72.28,107.55 Q5.2
N$52
  Bottom 0.254: R34.1 74.08,100.15 73.34,100.89 73.34,104.06 75.39,106.11 Q5.3
N$53
  Bottom 0.254: R33.1 92.92,68.76 X3.1
N$54
  Bottom 0.203: Q2.2 70.23,68.02 C10.1 70.38,65.54 69.06,64.22 IC2.1
N$58
  Bottom 0.254: D1.1 42.97,88.12 R3.1 42.55,86.28 41.91,85.65 41.91,85.01 40.49,83.59 P1.10
N$100  (via drill 0.3)
  Top 0.254: v91.76,104.7 95.25,104.7 95.57,105.01 95.57,127.24 91.12,131.68 X6.2
  Bottom 0.254: U2.13 v91.76,104.7
RX2  (via drill 0.3)
  Top 0.254: v91.12,105.33 94.61,105.33 94.93,105.65 94.93,126.92 92.71,129.14 X6.1
  Bottom 0.254: U2.12 92.21,105.2 92.08,105.33 v91.12,105.33
RXD
  Bottom 0.254: U2.2 96.94,110.2 97.79,111.05 FTDI.2
RXI_N  (via drill 0.3)
  Top 0.203: v51.44,121.21 51.82,121.21 57.61,115.42 57.61,104.77 57.22,104.38 v56.83,104.38
  Bottom 0.203: IC3.6 56.03,104.8 56.45,104.38 v56.83,104.38 | 51.87,121.12 51.31,121.68 51.31,121.71 51.44,121.59 v51.44,121.21
  Bottom 0.254: X1.2 49.53,123.46 51.87,121.12 51.87,118.75 51.15,118.03 50.16,118.03 49.53,117.4 R22.2
RXI_P  (via drill 0.3)
  Top 0.203: v57.28,103.74 57.28,103.94 57.96,104.62 57.96,115.56 52.07,121.46 v52.07,121.84
  Bottom 0.203: IC3.5 55.92,104.4 56.58,103.74 v57.28,103.74 | 51.9,121.67 51.6,121.97 51.56,121.97 51.69,121.84 v52.07,121.84
  Bottom 0.254: X1.1 50.8,122.76 51.9,121.67 52.27,121.29 52.27,118.58 51.44,117.74 R21.2
SCK  (via drill 0.3)
  Top 0.254: v99.38,101.52 91.44,101.52 78.42,114.54 v77.79,114.54 | v38.42,78.66 38.42,110.09 v42.23,113.9
  Bottom 0.203: IC1.16 42.64,114.6 42.86,114.38 53.98,114.38 54.29,114.7 54.29,118.67 54.93,119.3 61.91,119.3 63.18,118.03 68.58,118.03 69.22,118.67 77.47,118.67 78.42,117.71 78.42,115.17 v77.79,114.54
  Bottom 0.254: R40.2 98.74,102.79 99.38,102.16 v99.38,101.52 | v77.79,114.54 U1.5 | IC2.24 46.04,75.17 45.72,75.49 41.59,75.49 v38.42,78.66 | v42.23,113.9 42.39,113.9 42.86,114.38
SCK_3V3  (via drill 0.3)
  Top 0.203: 58.42,104.06 58.42,109.3 v58.58,109.46 | v75.56,115.17 69.53,115.17 v64.45,110.09 | v62.23,110.09 60.64,110.09 v60.48,109.93 | v97.47,74.85 97.16,75.17 97.16,93.11 88.58,101.52 v88.58,101.68 | v85.09,104.22 77.95,111.36 v77.47,111.36
  Top 0.254: v41.91,97.39 42.23,97.39 42.55,97.71 42.55,100.57 43.5,101.52 55.88,101.52 58.42,104.06
  Bottom 0.203: v58.58,109.46 60.01,109.46 v60.48,109.93 60.96,110.41 60.96,111.36 60.76,111.56 IC3.30 | U1.4 75.57,115.18 v75.56,115.17 74.93,114.54 74.93,113.11 76.68,111.36 v77.47,111.36 | v64.45,110.09 v62.23,110.09 | X3.5 96.05,73.43 v97.47,74.85 | v85.09,104.22 86.84,102.47 87.79,102.47 v88.58,101.68
  Bottom 0.254: P1.37 41.61,97.09 v41.91,97.39
SCK_PRG
  Bottom 0.254: R40.1 94.71,101.2 U2.20 92.7,101.2 92.39,100.89 92.39,97.71 94.77,95.33 94.77,91.2 94.3,90.73 ISP.3
SCL  (via drill 0.3)
  Top 0.254: v85.72,109.46 85.72,115.49 86.04,115.81 86.04,117.08 v85.72,117.4
  Bottom 0.254: X6.4 85.72,130.41 85.72,128.19 91.31,122.6 X5.10 91.31,121.08 88.9,118.67 R48.1 88.05,116.44 86.04,116.44 85.72,116.76 v85.72,117.4 | U2.43 83.22,97.99 82.55,98.66 82.55,105.65 85.72,108.82 v85.72,109.46
SDA  (via drill 0.3)
  Top 0.254: v85.09,110.09 85.09,115.81 85.41,116.13 85.41,116.76 85.09,117.08 v85.09,118.03
  Bottom 0.254: X6.3 84.45,127.24 87.81,123.88 X5.9 87.81,119.49 87,118.67 R46.1 86.26,118.03 v85.09,118.03 | U2.44 82.72,97.85 81.92,98.66 81.92,105.97 85.09,109.14 v85.09,110.09
SEN
  Bottom 0.203: IC3.31 61.16,113.39 60.01,114.54 R17.2 58.06,117.23 Q3.3
TFT_BL  (via drill 0.3)
  Top 0.254: v74.93,85.65 80.64,91.36 80.64,93.9 81.92,95.17 v84.77,95.17
  Bottom 0.254: R1.2 R2.1 47.94,84.48 47.94,84.38 52.39,84.38 53.34,83.42 55.88,83.42 58.1,85.65 v74.93,85.65 | v84.77,95.17 84.72,95.22 U2.40
TVDD
  Bottom 0.203: IC2.6 49.85,65.64 50.27,66.06 C6.1 60.64,66.06 L1.1
TXCT
  Bottom 0.254: X1.4 48.26,125.65 X1.3 49.53,128.19 53.98,128.19 54.71,128.93 C37.1
TXD
  Bottom 0.254: U2.3 98.66,109.7 99.38,110.41 99.38,117.71 98.74,118.35 FTDI.3
TXO_N  (via drill 0.3)
  Top 0.203: v56.19,106.15 56.34,106.3 56.34,107.8 53.8,110.34 53.8,113.51 50.73,116.58 48.19,116.58 44.91,119.86 44.91,121.52 44.59,121.84 v44.45,121.84
  Bottom 0.203: IC3.9 56.04,106 v56.19,106.15
  Bottom 0.254: X1.6 v44.45,121.84 44.45,120.28 46.47,118.26 46.47,117.72 R20.2
TXO_P  (via drill 0.3)
  Top 0.203: v56.83,105.83 56.69,105.97 56.69,107.94 54.15,110.48 54.15,113.66 50.87,116.94 48.33,116.94 45.26,120.01 45.26,121.52 45.58,121.84 v45.72,121.84
  Bottom 0.203: IC3.8 56.6,105.6 v56.83,105.83
  Bottom 0.254: X1.5 v45.72,121.84 45.72,119.59 46.88,118.43 46.88,117.72 R19.2
VCC
  pour Bottom: 34.29,108.5 34.29,132 31.75,132 31.75,114.86 20.83,114.86 20.83,108.5
VCC_NET
  Bottom 1.016: X7.2 24.48,133.63 24.77,133.91 35.56,133.91 38.1,136.45 40.64,136.45 42.55,134.54 42.55,132 40.64,130.1 X1.9
X+
  Bottom 0.203: P1.44 41.34,100.59 42.47,101.72 42.47,105.79 41.05,107.21 41.05,108.73 IC1.2
X-
  Bottom 0.203: P1.46 40.71,101.59 41.25,102.13 41.25,105.38 39.71,106.92 IC1.4
Y+
  Bottom 0.203: P1.45 41.02,101.09 41.86,101.93 41.86,105.58 40.36,107.08 IC1.3
Y-
  Bottom 0.203: P1.47 40.4,102.09 40.64,102.33 40.64,105.18 39.06,106.76 IC1.5

## Text on the board
Top: 1
Route2: 2
Route15: 3
Bottom: 4
tPlace: Universal Access Control System / Rev 1.0 | 08/2014 / Designed by Julian Neureuther / FAU FabLab
bPlace: + | MAC / address
bNames: GND | A3 | A2 | A1 | D6 | D4 | D2 | GND | 5V | SDA | SCL | 5V | TX | RX | + | X8 | + | + | + | + | + | PWR | Ethernet